# EAGLE design cabletester (EAGLE 9.6.2)
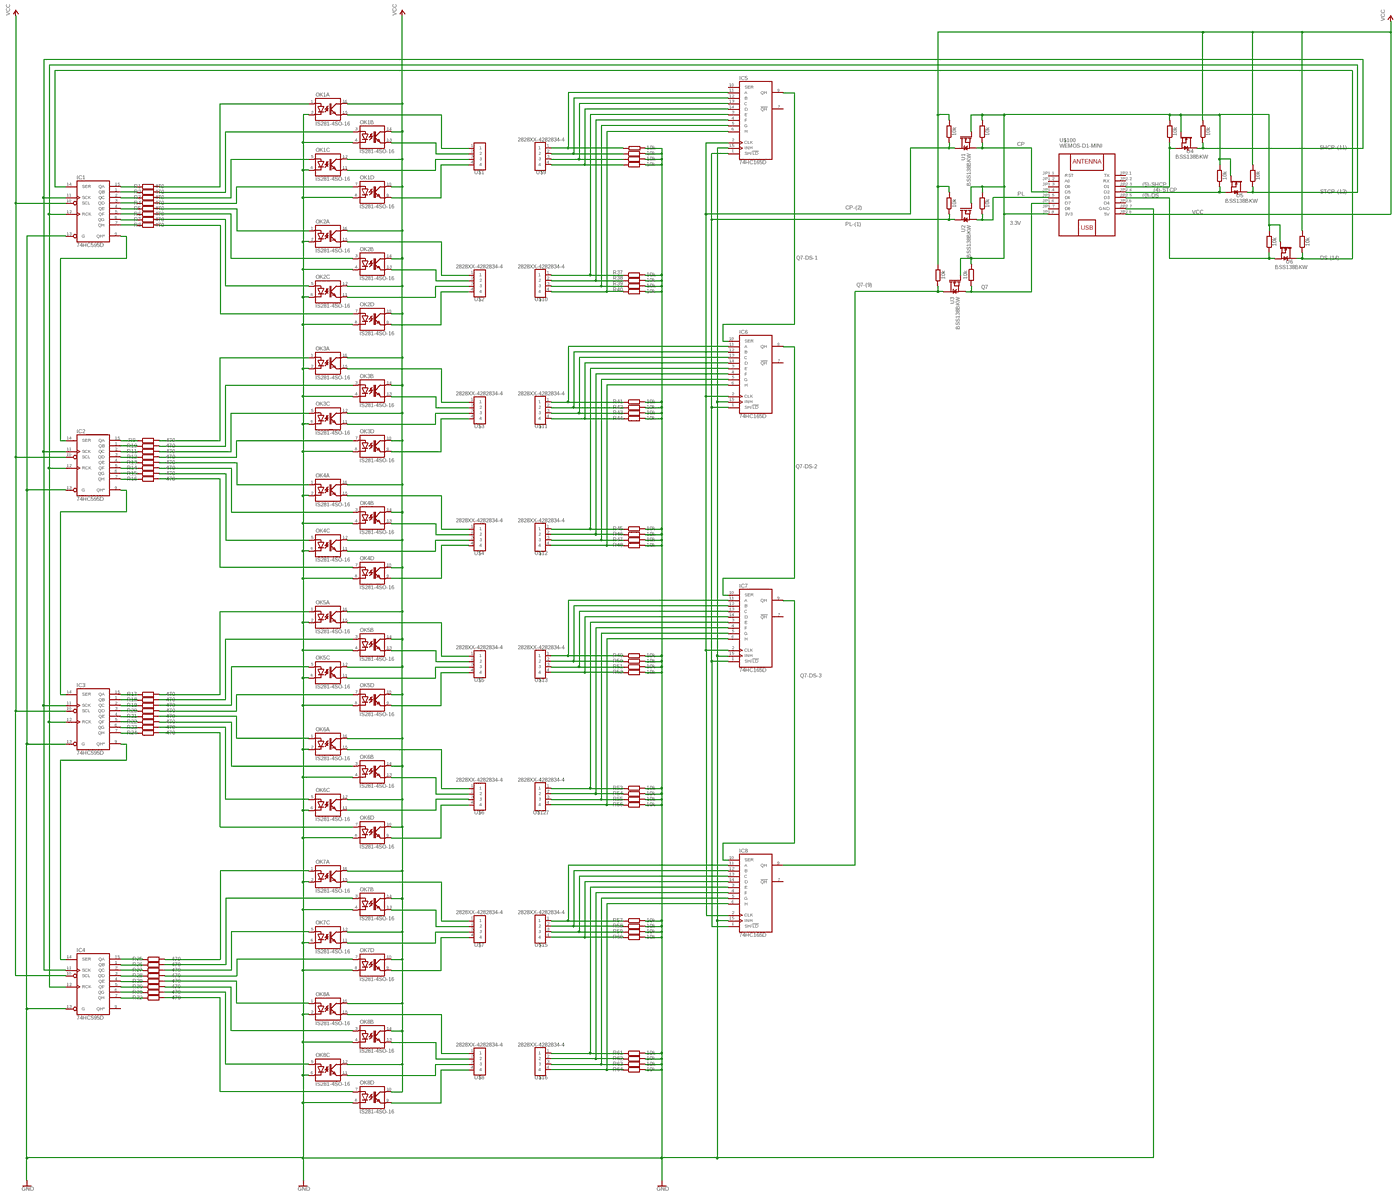
[diagram p0: schematic, sheet 1, overview]
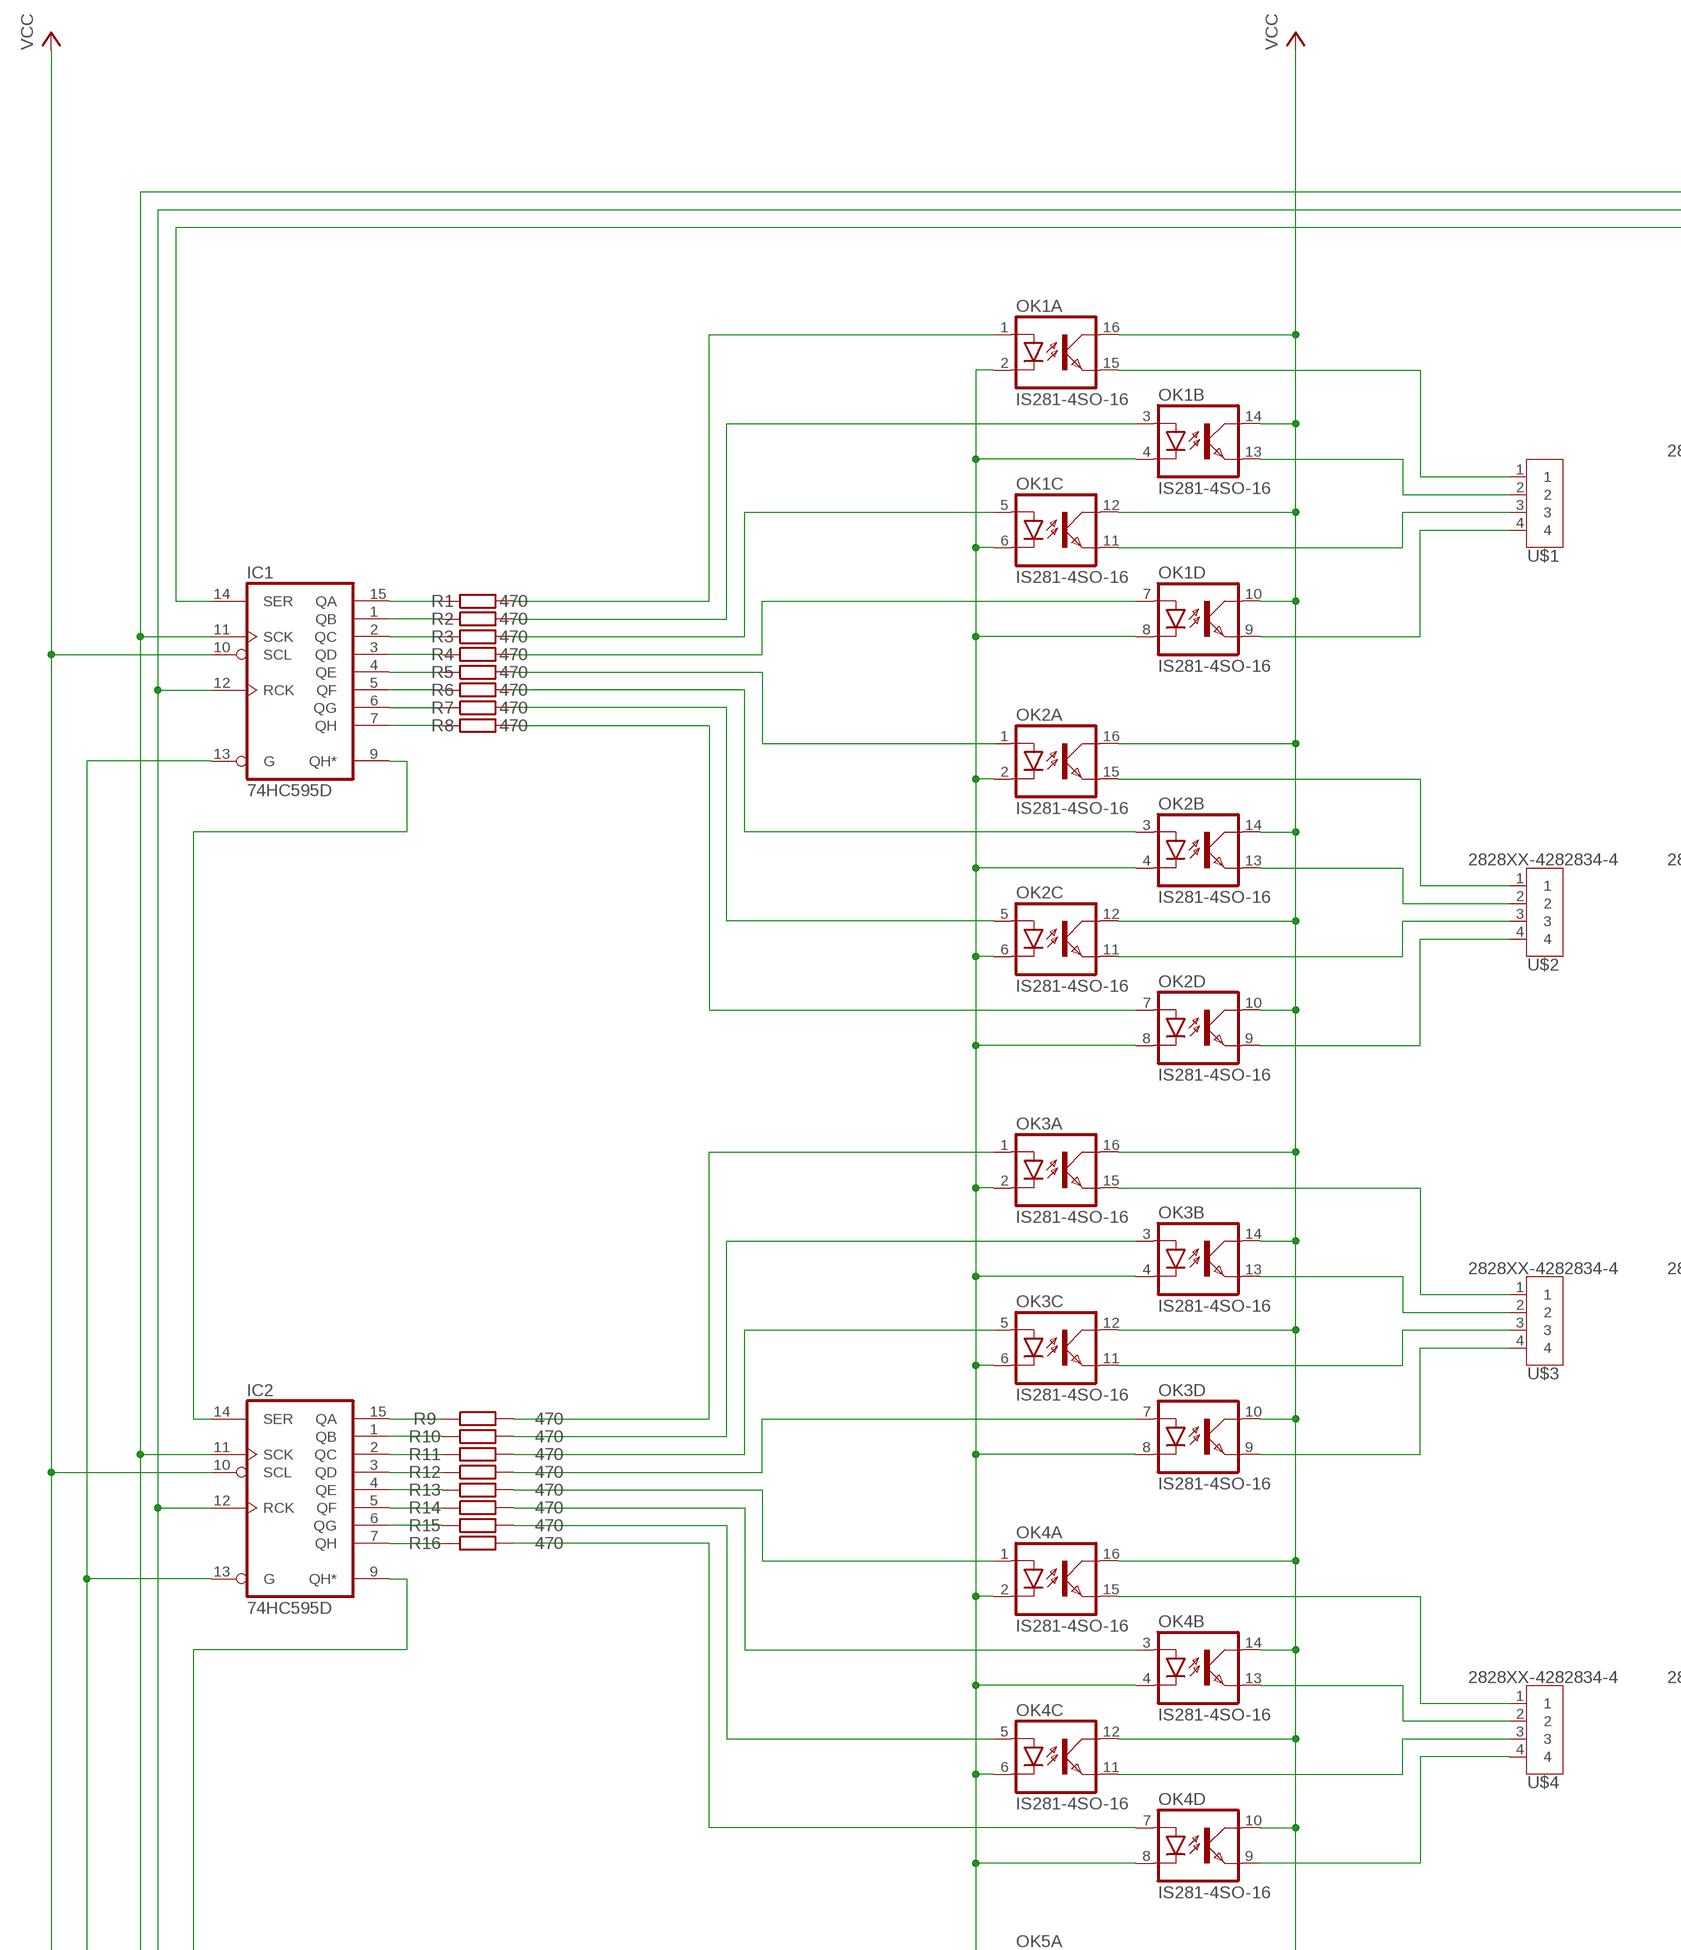
[diagram p1: schematic, sheet 1, part 1 of 4]
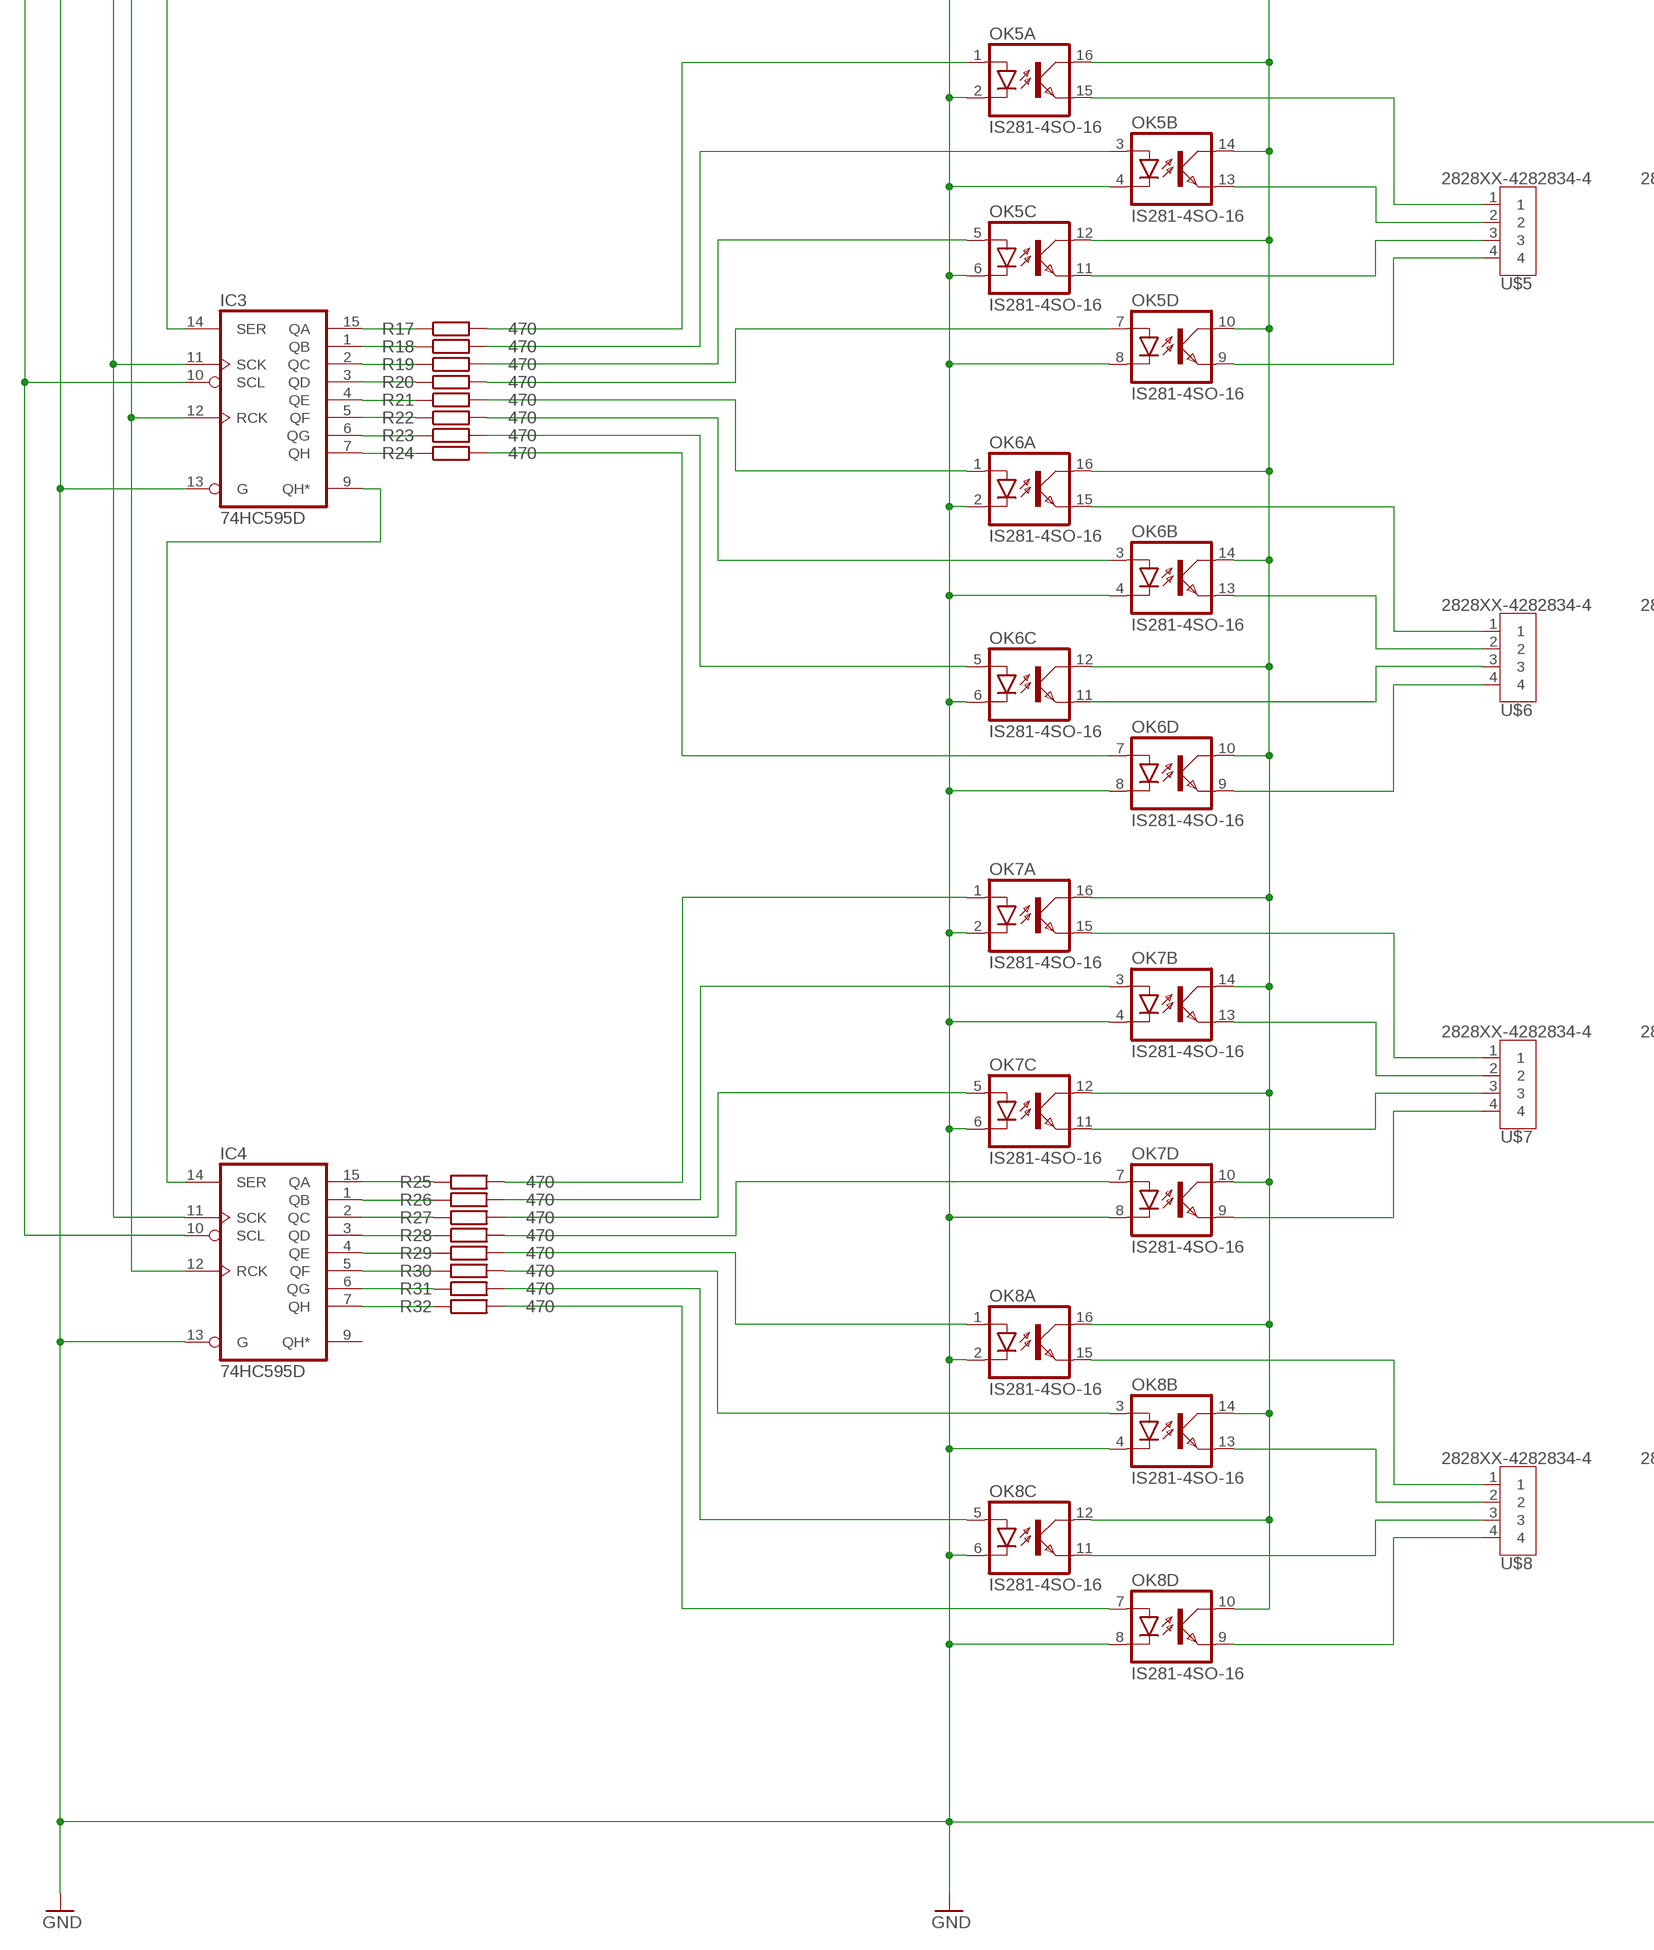
[diagram p2: schematic, sheet 1, part 2 of 4]
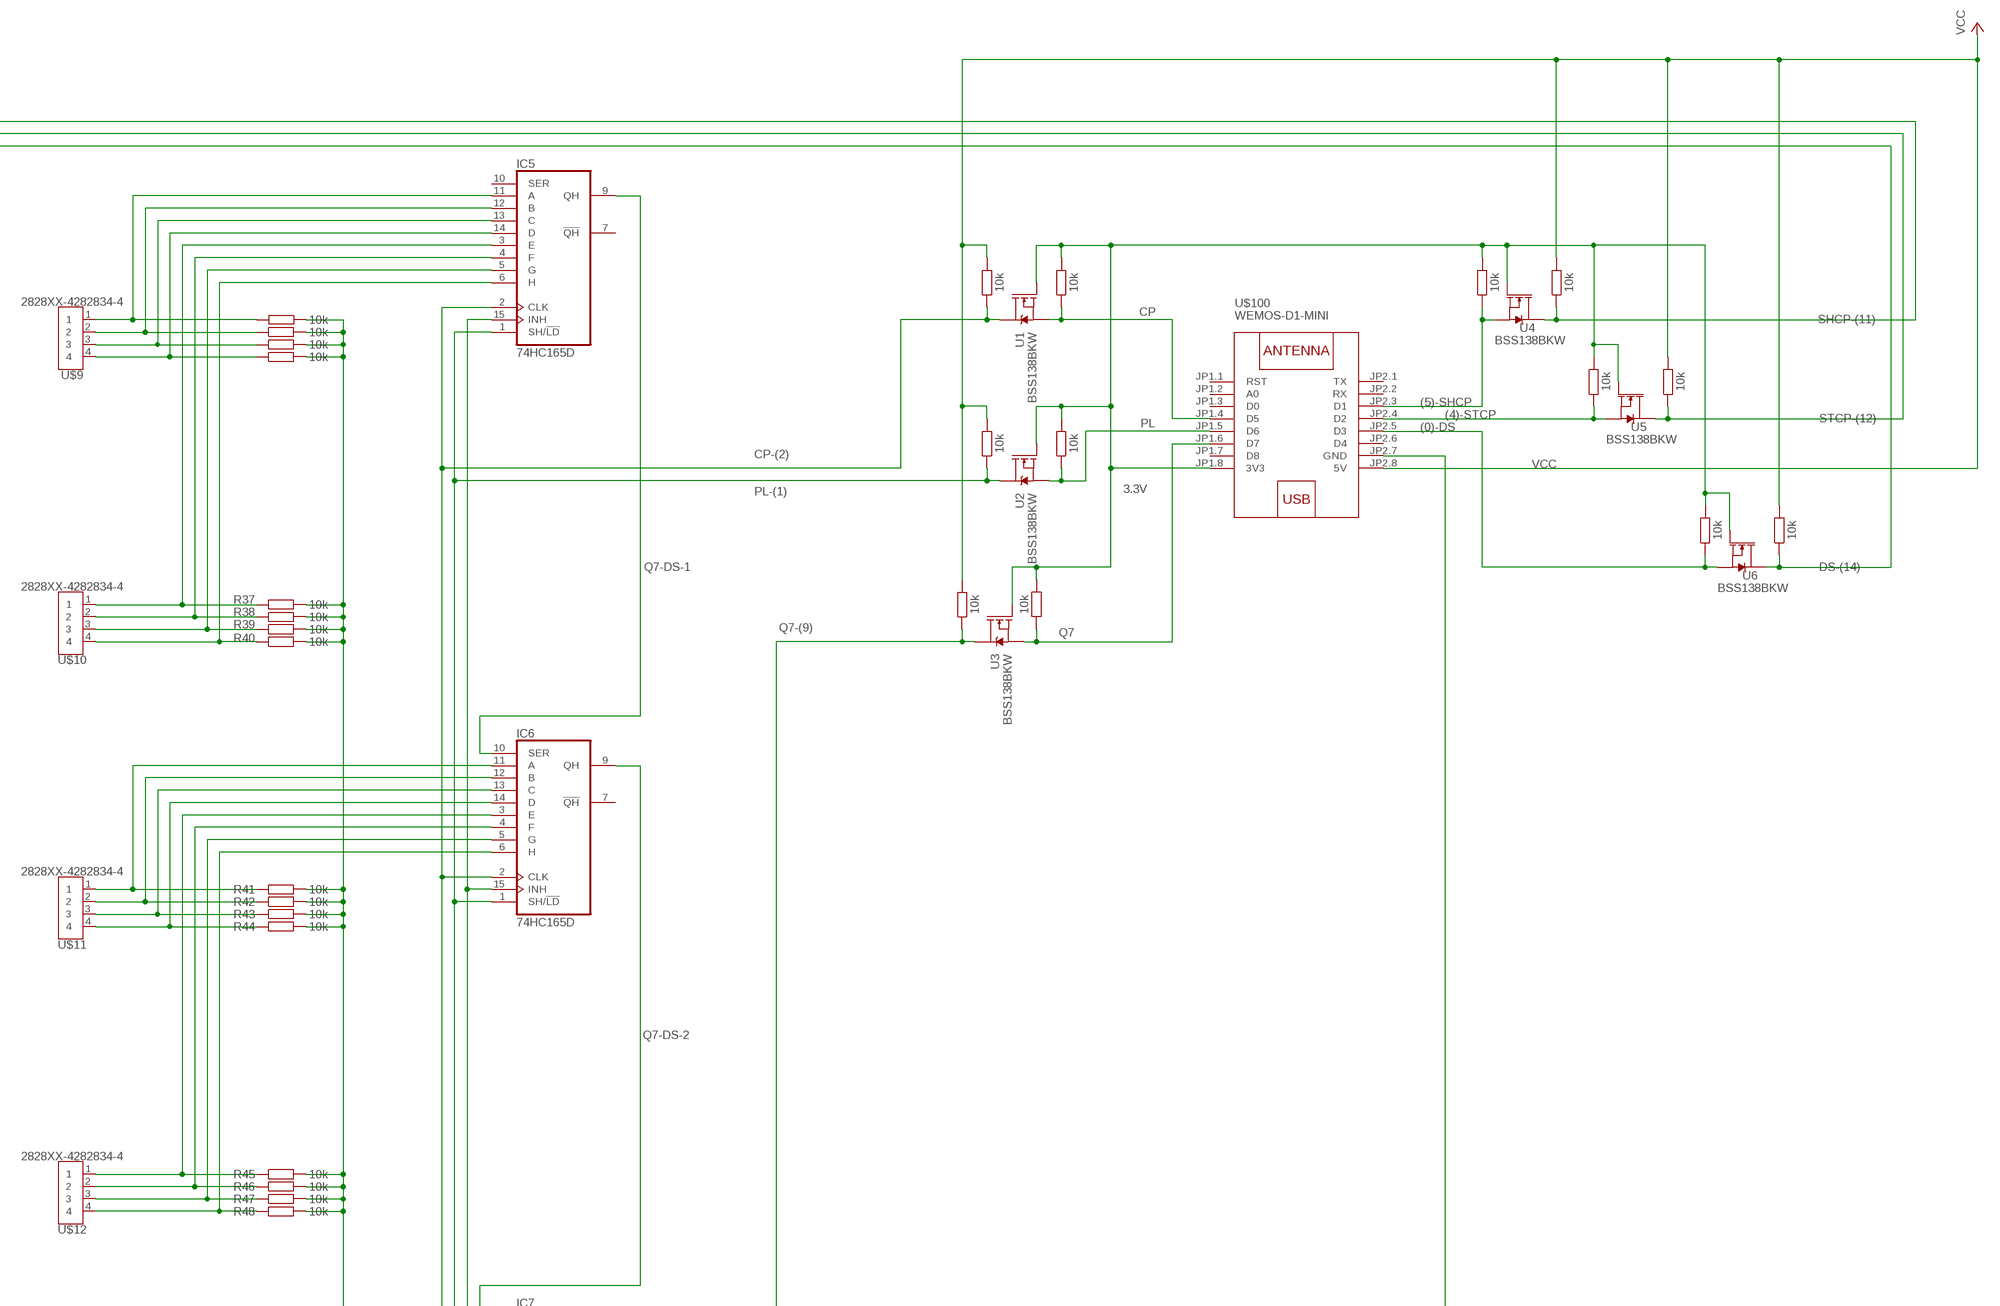
[diagram p3: schematic, sheet 1, part 3 of 4]
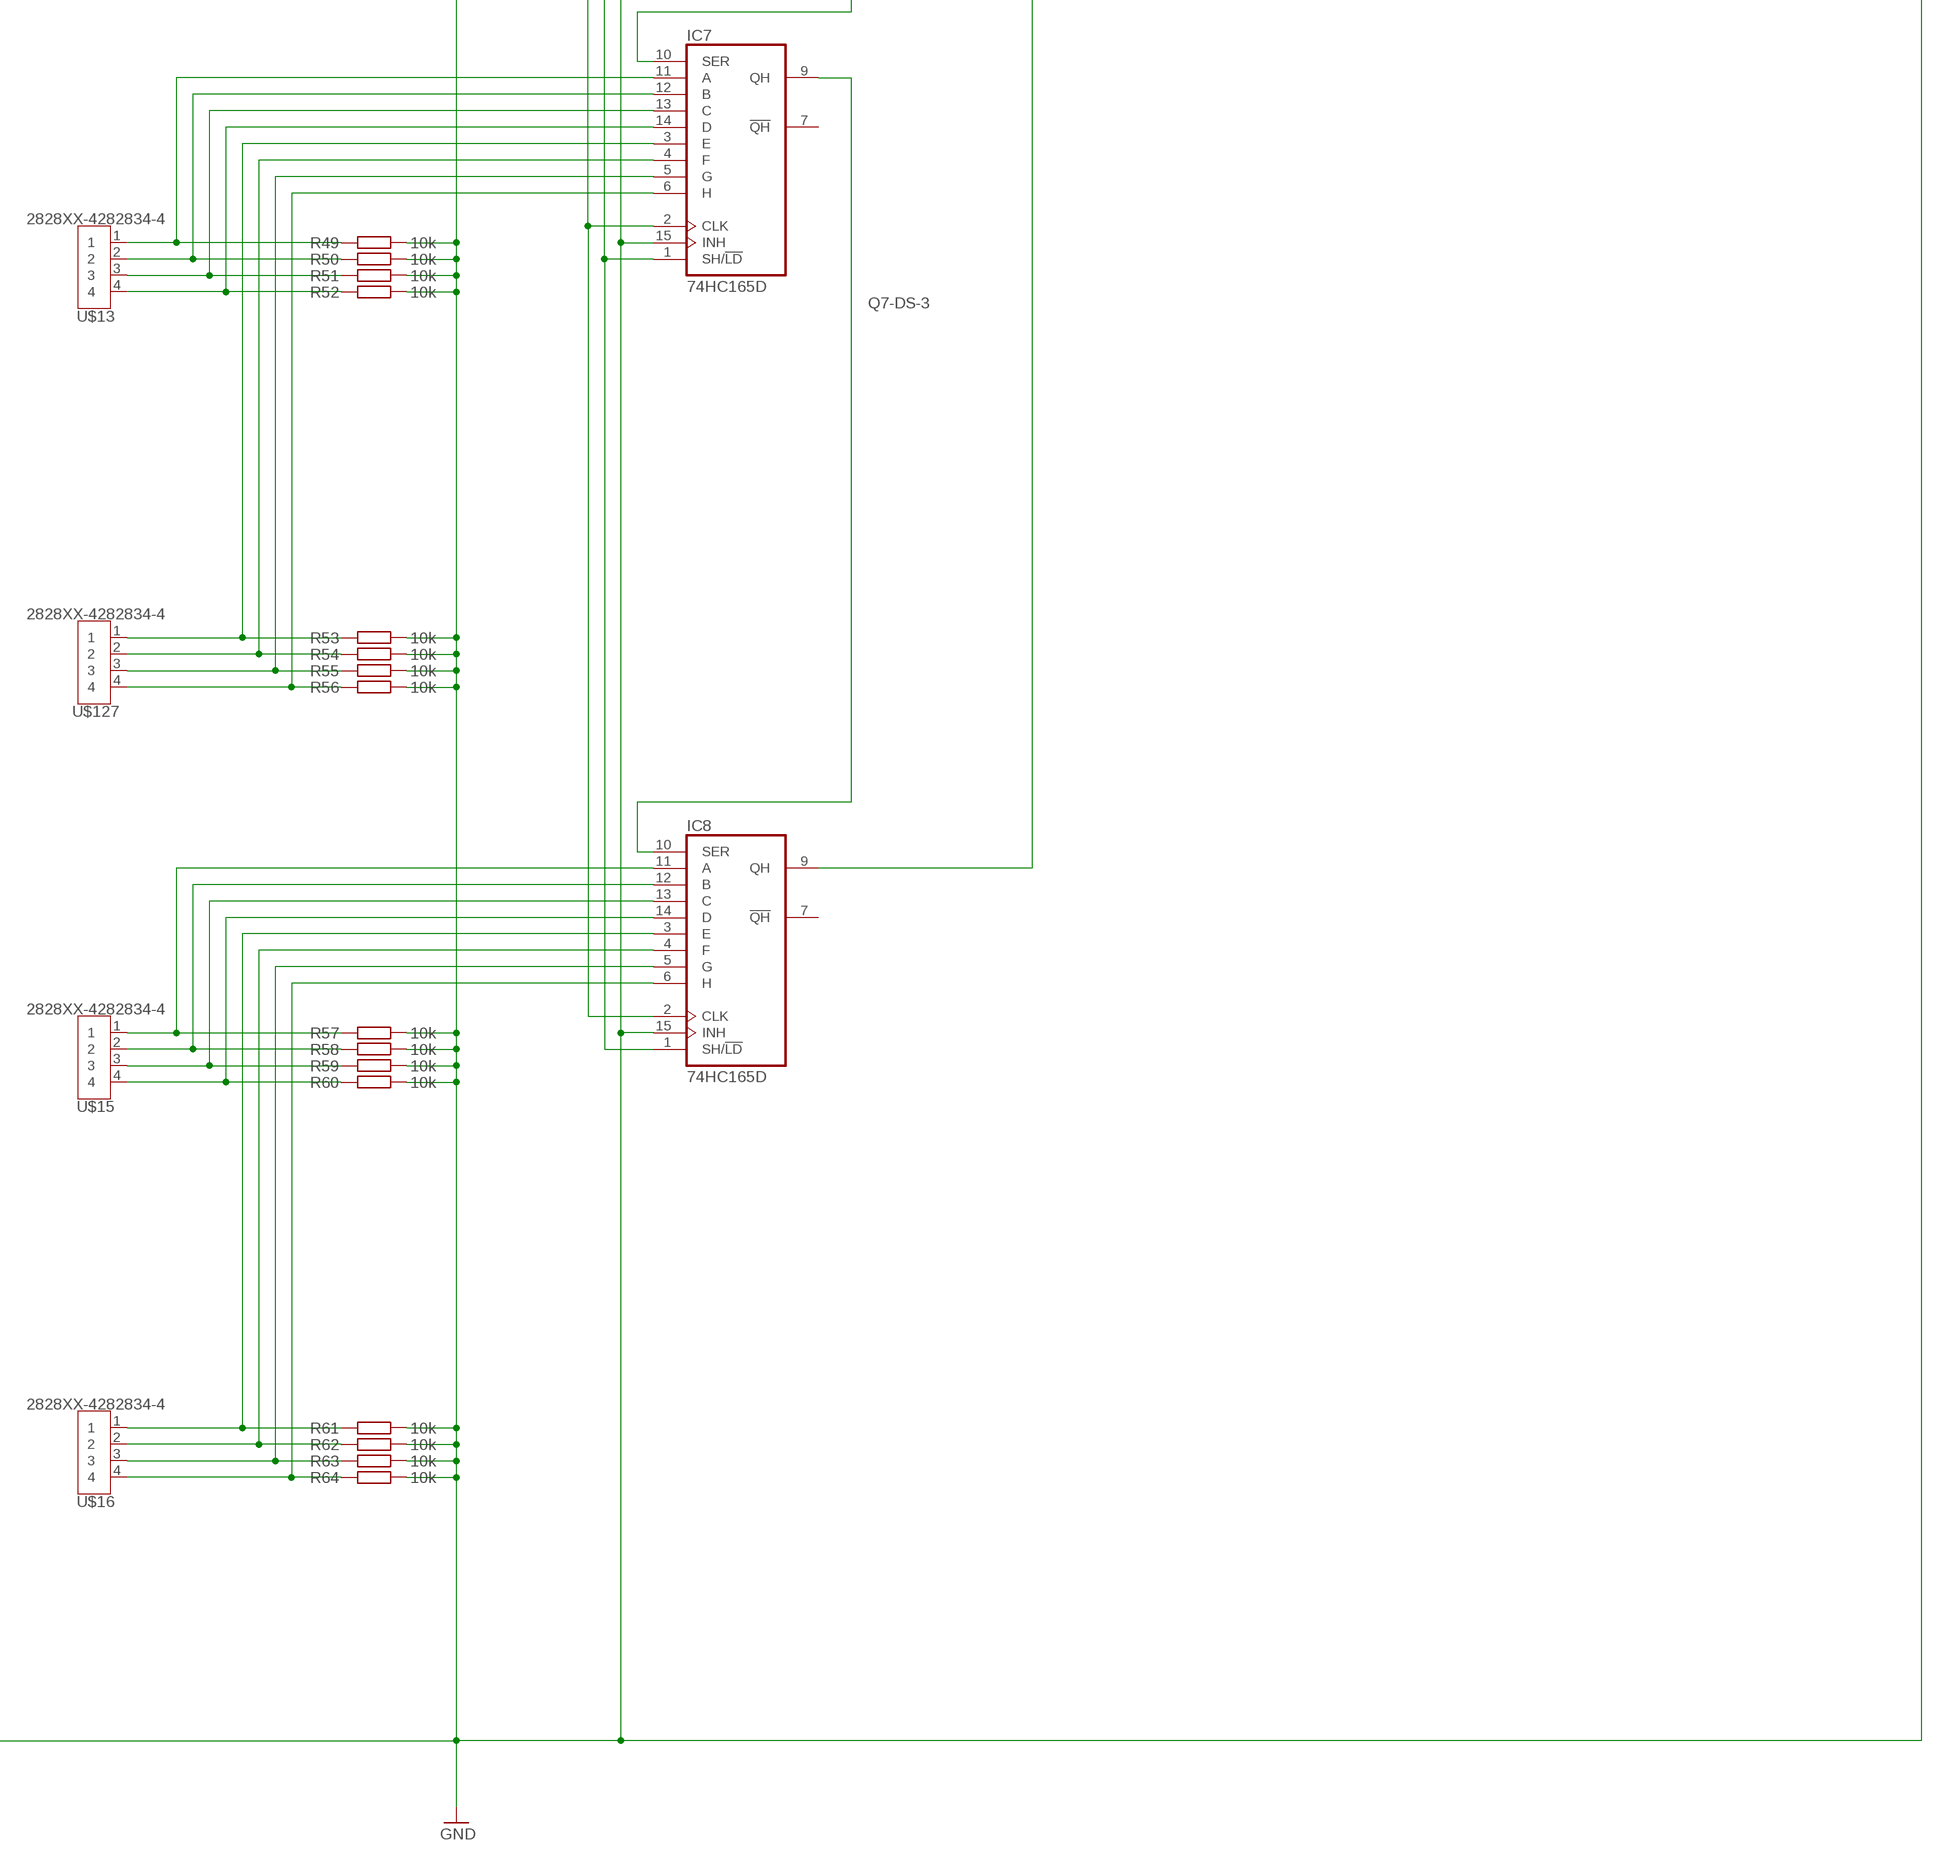
[diagram p4: schematic, sheet 1, part 4 of 4]

## Parts
IC1  74HC595D  [SO16]
IC2  74HC595D  [SO16]
IC3  74HC595D  [SO16]
IC4  74HC595D  [SO16]
IC5  74HC165D  [SO16]
IC6  74HC165D  [SO16]
IC7  74HC165D  [SO16]
IC8  74HC165D  [SO16]
OK1  IS281-4SO-16  [SO16]
OK2  IS281-4SO-16  [SO16]
OK3  IS281-4SO-16  [SO16]
OK4  IS281-4SO-16  [SO16]
OK5  IS281-4SO-16  [SO16]
OK6  IS281-4SO-16  [SO16]
OK7  IS281-4SO-16  [SO16]
OK8  IS281-4SO-16  [SO16]
R1  470  R_CHIP-1206(3216-METRIC)  [RESC3216X70]
R2  470  R_CHIP-1206(3216-METRIC)  [RESC3216X70]
R3  470  R_CHIP-1206(3216-METRIC)  [RESC3216X70]
R4  470  R_CHIP-1206(3216-METRIC)  [RESC3216X70]
R5  470  R_CHIP-1206(3216-METRIC)  [RESC3216X70]
R6  470  R_CHIP-1206(3216-METRIC)  [RESC3216X70]
R7  470  R_CHIP-1206(3216-METRIC)  [RESC3216X70]
R8  470  R_CHIP-1206(3216-METRIC)  [RESC3216X70]
R9  470  R_CHIP-1206(3216-METRIC)  [RESC3216X70]
R10  470  R_CHIP-1206(3216-METRIC)  [RESC3216X70]
R11  470  R_CHIP-1206(3216-METRIC)  [RESC3216X70]
R12  470  R_CHIP-1206(3216-METRIC)  [RESC3216X70]
R13  470  R_CHIP-1206(3216-METRIC)  [RESC3216X70]
R14  470  R_CHIP-1206(3216-METRIC)  [RESC3216X70]
R15  470  R_CHIP-1206(3216-METRIC)  [RESC3216X70]
R16  470  R_CHIP-1206(3216-METRIC)  [RESC3216X70]
R17  470  R_CHIP-1206(3216-METRIC)  [RESC3216X70]
R18  470  R_CHIP-1206(3216-METRIC)  [RESC3216X70]
R19  470  R_CHIP-1206(3216-METRIC)  [RESC3216X70]
R20  470  R_CHIP-1206(3216-METRIC)  [RESC3216X70]
R21  470  R_CHIP-1206(3216-METRIC)  [RESC3216X70]
R22  470  R_CHIP-1206(3216-METRIC)  [RESC3216X70]
R23  470  R_CHIP-1206(3216-METRIC)  [RESC3216X70]
R24  470  R_CHIP-1206(3216-METRIC)  [RESC3216X70]
R25  470  R_CHIP-1206(3216-METRIC)  [RESC3216X70]
R26  470  R_CHIP-1206(3216-METRIC)  [RESC3216X70]
R27  470  R_CHIP-1206(3216-METRIC)  [RESC3216X70]
R28  470  R_CHIP-1206(3216-METRIC)  [RESC3216X70]
R29  470  R_CHIP-1206(3216-METRIC)  [RESC3216X70]
R30  470  R_CHIP-1206(3216-METRIC)  [RESC3216X70]
R31  470  R_CHIP-1206(3216-METRIC)  [RESC3216X70]
R32  470  R_CHIP-1206(3216-METRIC)  [RESC3216X70]
R33  10k  R_CHIP-1206(3216-METRIC)  [RESC3216X70]
R34  10k  R_CHIP-1206(3216-METRIC)  [RESC3216X70]
R35  10k  R_CHIP-1206(3216-METRIC)  [RESC3216X70]
R36  10k  R_CHIP-1206(3216-METRIC)  [RESC3216X70]
R37  10k  R_CHIP-1206(3216-METRIC)  [RESC3216X70]
R38  10k  R_CHIP-1206(3216-METRIC)  [RESC3216X70]
R39  10k  R_CHIP-1206(3216-METRIC)  [RESC3216X70]
R40  10k  R_CHIP-1206(3216-METRIC)  [RESC3216X70]
R41  10k  R_CHIP-1206(3216-METRIC)  [RESC3216X70]
R42  10k  R_CHIP-1206(3216-METRIC)  [RESC3216X70]
R43  10k  R_CHIP-1206(3216-METRIC)  [RESC3216X70]
R44  10k  R_CHIP-1206(3216-METRIC)  [RESC3216X70]
R45  10k  R_CHIP-1206(3216-METRIC)  [RESC3216X70]
R46  10k  R_CHIP-1206(3216-METRIC)  [RESC3216X70]
R47  10k  R_CHIP-1206(3216-METRIC)  [RESC3216X70]
R48  10k  R_CHIP-1206(3216-METRIC)  [RESC3216X70]
R49  10k  R_CHIP-1206(3216-METRIC)  [RESC3216X70]
R50  10k  R_CHIP-1206(3216-METRIC)  [RESC3216X70]
R51  10k  R_CHIP-1206(3216-METRIC)  [RESC3216X70]
R52  10k  R_CHIP-1206(3216-METRIC)  [RESC3216X70]
R53  10k  R_CHIP-1206(3216-METRIC)  [RESC3216X70]
R54  10k  R_CHIP-1206(3216-METRIC)  [RESC3216X70]
R55  10k  R_CHIP-1206(3216-METRIC)  [RESC3216X70]
R56  10k  R_CHIP-1206(3216-METRIC)  [RESC3216X70]
R57  10k  R_CHIP-1206(3216-METRIC)  [RESC3216X70]
R58  10k  R_CHIP-1206(3216-METRIC)  [RESC3216X70]
R59  10k  R_CHIP-1206(3216-METRIC)  [RESC3216X70]
R60  10k  R_CHIP-1206(3216-METRIC)  [RESC3216X70]
R61  10k  R_CHIP-1206(3216-METRIC)  [RESC3216X70]
R62  10k  R_CHIP-1206(3216-METRIC)  [RESC3216X70]
R63  10k  R_CHIP-1206(3216-METRIC)  [RESC3216X70]
R64  10k  R_CHIP-1206(3216-METRIC)  [RESC3216X70]
R65  10k  R_CHIP-1206(3216-METRIC)  [RESC3216X70]
R66  10k  R_CHIP-1206(3216-METRIC)  [RESC3216X70]
R67  10k  R_CHIP-1206(3216-METRIC)  [RESC3216X70]
R68  10k  R_CHIP-1206(3216-METRIC)  [RESC3216X70]
R69  10k  R_CHIP-1206(3216-METRIC)  [RESC3216X70]
R70  10k  R_CHIP-1206(3216-METRIC)  [RESC3216X70]
R71  10k  R_CHIP-1206(3216-METRIC)  [RESC3216X70]
R72  10k  R_CHIP-1206(3216-METRIC)  [RESC3216X70]
R73  10k  R_CHIP-1206(3216-METRIC)  [RESC3216X70]
R74  10k  R_CHIP-1206(3216-METRIC)  [RESC3216X70]
R75  10k  R_CHIP-1206(3216-METRIC)  [RESC3216X70]
R76  10k  R_CHIP-1206(3216-METRIC)  [RESC3216X70]
U1  BSS138BKW  [SOT65P210X110-3N]
U2  BSS138BKW  [SOT65P210X110-3N]
U3  BSS138BKW  [SOT65P210X110-3N]
U4  BSS138BKW  [SOT65P210X110-3N]
U5  BSS138BKW  [SOT65P210X110-3N]
U6  BSS138BKW  [SOT65P210X110-3N]
U$1  2828XX-4282834-4  [TERMBLK_254-4N]
U$2  2828XX-4282834-4  [TERMBLK_254-4N]
U$3  2828XX-4282834-4  [TERMBLK_254-4N]
U$4  2828XX-4282834-4  [TERMBLK_254-4N]
U$5  2828XX-4282834-4  [TERMBLK_254-4N]
U$6  2828XX-4282834-4  [TERMBLK_254-4N]
U$7  2828XX-4282834-4  [TERMBLK_254-4N]
U$8  2828XX-4282834-4  [TERMBLK_254-4N]
U$9  2828XX-4282834-4  [TERMBLK_254-4N]
U$10  2828XX-4282834-4  [TERMBLK_254-4N]
U$11  2828XX-4282834-4  [TERMBLK_254-4N]
U$12  2828XX-4282834-4  [TERMBLK_254-4N]
U$13  2828XX-4282834-4  [TERMBLK_254-4N]
U$15  2828XX-4282834-4  [TERMBLK_254-4N]
U$16  2828XX-4282834-4  [TERMBLK_254-4N]
U$100  WEMOS-D1-MINI  [WEMOS-D1-MINI]
U$127  2828XX-4282834-4  [TERMBLK_254-4N]

## Nets
3.3V: R66.2 R68.2 R70.1 R71.2 R73.2 R75.2 U1.1(G) U2.1(G) U3.1(G) U4.1(G) U5.1(G) U6.1(G) U$100.JP1.8(3V3)
(0)-DS: R75.1 U6.2(S) U$100.JP2.5(D3)
(4)-STCP: R73.1 U5.2(S) U$100.JP2.4(D2)
(5)-SHCP: R71.1 U4.2(S) U$100.JP2.3(D1)
CP: R66.1 U1.2(S) U$100.JP1.4(D5)
CP-(2): IC5.2(CLK) IC6.2(CLK) IC7.2(CLK) IC8.2(CLK) R65.1 U1.3(D)
DS-(14): IC1.14(SER) R76.1 U6.3(D)
GND: IC1.13(G) IC2.13(G) IC3.13(G) IC4.13(G) IC5.15(INH) IC6.15(INH) IC7.15(INH) IC8.15(INH) OK1.2(A:C) OK1.4(B:C) OK1.6(C:C) OK1.8(D:C) OK2.2(A:C) OK2.4(B:C) OK2.6(C:C) OK2.8(D:C) OK3.2(A:C) OK3.4(B:C) OK3.6(C:C) OK3.8(D:C) OK4.2(A:C) OK4.4(B:C) OK4.6(C:C) OK4.8(D:C) OK5.2(A:C) OK5.4(B:C) OK5.6(C:C) OK5.8(D:C) OK6.2(A:C) OK6.4(B:C) OK6.6(C:C) OK6.8(D:C) OK7.2(A:C) OK7.4(B:C) OK7.6(C:C) OK7.8(D:C) OK8.2(A:C) OK8.4(B:C) OK8.6(C:C) OK8.8(D:C) R33.2 R34.2 R35.2 R36.2 R37.2 R38.2 R39.2 R40.2 R41.2 R42.2 R43.2 R44.2 R45.2 R46.2 R47.2 R48.2 R49.2 R50.2 R51.2 R52.2 R53.2 R54.2 R55.2 R56.2 R57.2 R58.2 R59.2 R60.2 R61.2 R62.2 R63.2 R64.2 U$100.JP2.7(GND)
N$1: IC4.1(QB) R26.1
N$2: IC1.9(QH*) IC2.14(SER)
N$3: IC2.9(QH*) IC3.14(SER)
N$4: IC3.9(QH*) IC4.14(SER)
N$5: OK7.1(A:A) R25.2
N$6: IC1.6(QG) R7.1
N$7: IC1.5(QF) R6.1
N$8: IC1.4(QE) R5.1
N$9: IC1.3(QD) R4.1
N$10: IC1.2(QC) R3.1
N$11: IC1.1(QB) R2.1
N$12: IC1.15(QA) R1.1
N$13: IC1.7(QH) R8.1
N$14: OK1.1(A:A) R1.2
N$15: OK1.3(B:A) R2.2
N$16: OK1.5(C:A) R3.2
N$17: OK1.7(D:A) R4.2
N$18: OK2.1(A:A) R5.2
N$19: OK2.3(B:A) R6.2
N$20: OK1.15(A:EMIT) U$1.1
N$21: OK1.13(B:EMIT) U$1.2
N$22: OK1.11(C:EMIT) U$1.3
N$23: OK1.9(D:EMIT) U$1.4
N$24: OK2.15(A:EMIT) U$2.1
N$25: OK2.13(B:EMIT) U$2.2
N$26: OK2.11(C:EMIT) U$2.3
N$27: OK2.9(D:EMIT) U$2.4
N$28: OK2.5(C:A) R7.2
N$29: OK2.7(D:A) R8.2
N$30: IC2.1(QB) R10.1
N$31: IC2.2(QC) R11.1
N$32: IC2.3(QD) R12.1
N$33: IC2.4(QE) R13.1
N$34: IC2.5(QF) R14.1
N$35: IC2.6(QG) R15.1
N$36: IC2.7(QH) R16.1
N$37: IC2.15(QA) R9.1
N$38: OK3.1(A:A) R9.2
N$39: OK3.3(B:A) R10.2
N$40: OK3.5(C:A) R11.2
N$41: OK3.7(D:A) R12.2
N$42: OK4.1(A:A) R13.2
N$43: OK4.3(B:A) R14.2
N$44: OK4.5(C:A) R15.2
N$45: OK4.7(D:A) R16.2
N$46: IC3.6(QG) R23.1
N$47: IC3.5(QF) R22.1
N$48: IC3.4(QE) R21.1
N$49: IC3.3(QD) R20.1
N$50: IC3.2(QC) R19.1
N$51: IC3.1(QB) R18.1
N$52: IC3.7(QH) R24.1
N$53: IC3.15(QA) R17.1
N$54: OK5.1(A:A) R17.2
N$55: OK5.3(B:A) R18.2
N$56: OK5.5(C:A) R19.2
N$57: OK5.7(D:A) R20.2
N$58: OK6.1(A:A) R21.2
N$59: OK6.3(B:A) R22.2
N$60: OK6.5(C:A) R23.2
N$61: OK6.7(D:A) R24.2
N$62: OK7.3(B:A) R26.2
N$63: OK7.5(C:A) R27.2
N$64: OK7.7(D:A) R28.2
N$65: OK8.1(A:A) R29.2
N$66: OK3.15(A:EMIT) U$3.1
N$67: OK3.13(B:EMIT) U$3.2
N$68: OK3.11(C:EMIT) U$3.3
N$69: OK3.9(D:EMIT) U$3.4
N$70: OK4.15(A:EMIT) U$4.1
N$71: OK4.13(B:EMIT) U$4.2
N$72: OK4.11(C:EMIT) U$4.3
N$73: OK4.9(D:EMIT) U$4.4
N$74: OK5.15(A:EMIT) U$5.1
N$75: OK5.13(B:EMIT) U$5.2
N$76: OK5.11(C:EMIT) U$5.3
N$77: OK5.9(D:EMIT) U$5.4
N$78: OK6.15(A:EMIT) U$6.1
N$79: OK6.13(B:EMIT) U$6.2
N$80: OK6.11(C:EMIT) U$6.3
N$81: OK6.9(D:EMIT) U$6.4
N$82: IC5.11(A) R33.1 U$9.1
N$83: IC6.11(A) R41.1 U$11.1
N$84: IC5.13(C) R35.1 U$9.3
N$85: IC5.14(D) R36.1 U$9.4
N$86: IC5.12(B) R34.1 U$9.2
N$87: IC6.12(B) R42.1 U$11.2
N$88: IC5.3(E) R37.1 U$10.1
N$89: IC5.4(F) R38.1 U$10.2
N$90: IC5.5(G) R39.1 U$10.3
N$91: IC5.6(H) R40.1 U$10.4
N$92: IC6.13(C) R43.1 U$11.3
N$93: IC6.14(D) R44.1 U$11.4
N$94: IC6.3(E) R45.1 U$12.1
N$95: IC6.4(F) R46.1 U$12.2
N$96: IC6.5(G) R47.1 U$12.3
N$97: IC6.6(H) R48.1 U$12.4
N$98: IC7.11(A) R49.1 U$13.1
N$99: IC7.12(B) R50.1 U$13.2
N$100: IC7.13(C) R51.1 U$13.3
N$101: IC7.14(D) R52.1 U$13.4
N$102: IC7.3(E) R53.1 U$127.1
N$103: IC7.4(F) R54.1 U$127.2
N$104: IC7.5(G) R55.1 U$127.3
N$105: IC7.6(H) R56.1 U$127.4
N$106: OK8.3(B:A) R30.2
N$107: OK8.5(C:A) R31.2
N$108: OK8.7(D:A) R32.2
N$109: IC4.2(QC) R27.1
N$110: IC4.3(QD) R28.1
N$111: IC4.4(QE) R29.1
N$112: IC4.5(QF) R30.1
N$113: IC4.6(QG) R31.1
N$114: IC4.7(QH) R32.1
N$116: IC4.15(QA) R25.1
N$117: OK7.15(A:EMIT) U$7.1
N$118: OK7.13(B:EMIT) U$7.2
N$119: OK7.11(C:EMIT) U$7.3
N$120: OK7.9(D:EMIT) U$7.4
N$121: OK8.15(A:EMIT) U$8.1
N$122: OK8.13(B:EMIT) U$8.2
N$123: OK8.11(C:EMIT) U$8.3
N$124: OK8.9(D:EMIT) U$8.4
N$125: IC8.11(A) R57.1 U$15.1
N$126: IC8.12(B) R58.1 U$15.2
N$127: IC8.13(C) R59.1 U$15.3
N$128: IC8.14(D) R60.1 U$15.4
N$129: IC8.3(E) R61.1 U$16.1
N$130: IC8.4(F) R62.1 U$16.2
N$131: IC8.5(G) R63.1 U$16.3
N$132: IC8.6(H) R64.1 U$16.4
PL: R68.1 U2.2(S) U$100.JP1.5(D6)
PL-(1): IC5.1(SH/!LD) IC6.1(SH/!LD) IC7.1(SH/!LD) IC8.1(SH/!LD) R67.1 U2.3(D)
Q7: R70.2 U3.2(S) U$100.JP1.6(D7)
Q7-(9): IC8.9(QH) R69.1 U3.3(D)
Q7-DS-1: IC5.9(QH) IC6.10(SER)
Q7-DS-2: IC6.9(QH) IC7.10(SER)
Q7-DS-3: IC7.9(QH) IC8.10(SER)
SHCP-(11): IC1.11(SCK) IC2.11(SCK) IC3.11(SCK) IC4.11(SCK) R72.1 U4.3(D)
STCP-(12): IC1.12(RCK) IC2.12(RCK) IC3.12(RCK) IC4.12(RCK) R74.1 U5.3(D)
VCC: IC1.10(SCL) IC2.10(SCL) IC3.10(SCL) IC4.10(SCL) OK1.10(D:COL) OK1.12(C:COL) OK1.14(B:COL) OK1.16(A:COL) OK2.10(D:COL) OK2.12(C:COL) OK2.14(B:COL) OK2.16(A:COL) OK3.10(D:COL) OK3.12(C:COL) OK3.14(B:COL) OK3.16(A:COL) OK4.10(D:COL) OK4.12(C:COL) OK4.14(B:COL) OK4.16(A:COL) OK5.10(D:COL) OK5.12(C:COL) OK5.14(B:COL) OK5.16(A:COL) OK6.10(D:COL) OK6.12(C:COL) OK6.14(B:COL) OK6.16(A:COL) OK7.10(D:COL) OK7.12(C:COL) OK7.14(B:COL) OK7.16(A:COL) OK8.10(D:COL) OK8.12(C:COL) OK8.14(B:COL) OK8.16(A:COL) R65.2 R67.2 R69.2 R72.2 R74.2 R76.2 U$100.JP2.8(5V)
Unconnected: IC4.9(QH*) IC5.7(!QH) IC5.10(SER) IC6.7(!QH) IC7.7(!QH) IC8.7(!QH) U$100.JP1.1(RST) U$100.JP1.2(A0) U$100.JP1.3(D0) U$100.JP1.7(D8) U$100.JP2.1(TX) U$100.JP2.2(RX) U$100.JP2.6(D4)

## Power pins joined to a net without a drawn wire
GND: IC1.8(GND) IC2.8(GND) IC3.8(GND) IC4.8(GND) IC5.8(GND) IC6.8(GND) IC7.8(GND) IC8.8(GND)
VCC: IC1.16(VCC) IC2.16(VCC) IC3.16(VCC) IC4.16(VCC) IC5.16(VCC) IC6.16(VCC) IC7.16(VCC) IC8.16(VCC)

## Library data of the parts
IC1-IC4 = 74xx-eu:74*595: 8-bit SHIFT REGISTER, output latch
IC5-IC8 = 74xx-eu:74*165: 8-bit parallel load SHIFT REGISTER
OK1-OK8 = IS281-4-optocoupler:IS281-4: ISOCOM IS281-4 PHOTOCOUPLER
R1-R76 = Resistor:R: Resistor Fixed - Generic; CATEGORY: Resistor; SUB-CATEGORY: Fixed
U1-U6 = bss138:BSS138BKW: N-channel Trench MOSFET; MPN: BSS138BKW; OC_FARNELL: 2053836; OC_NEWARK: 61T7488; PACKAGE: SOT-23-3; SUPPLIER: NXP
U$1-U$13 U$15 U$16 U$127 = Connector:2828XX-4: 4 Position Wire to Board Terminal Block Horizontal with Board Datasheet <https://www.te.com.cn/commerce/DocumentDelivery/DDEController?Action=showdoc&DocId=Catalog+Section%7F1308389_EUROSTYLE_TERMINAL_BLOCKS%7F0607%7Fpdf%7FEnglish%7FENG_CS_1308389_EUROSTYLE_TERMINAL_BLOCKS_0607.pdf%7F2-282837-5>; CATEGORY: Connector; DESCRIPTION: TERM BLK 4P SIDE ENT 2.54mm PCB; MANUFACTURER: TE Connectivity; MPN: 282834-4; OPERATING_TEMPERATURE: 40°C to +105°C; PART_STATUS: Active; ROHS_COMPLIANCE: RoHS Compliant; SERIES: 282834; SUBCATEGORY: Terminal Block; TYPE: Side Wire Entry
U$100 = diy-modules:WEMOS-D1-MINI: WEMOS D1 mini: Mini Wi-Fi Board based on ESP-8266 device More details can be found here: https://www.wemos.cc/product/d1-mini.html Click here to find device on ebay.com <http://www.ebay.com/sch/wemos+d1+mini+nodemcu>

## Board
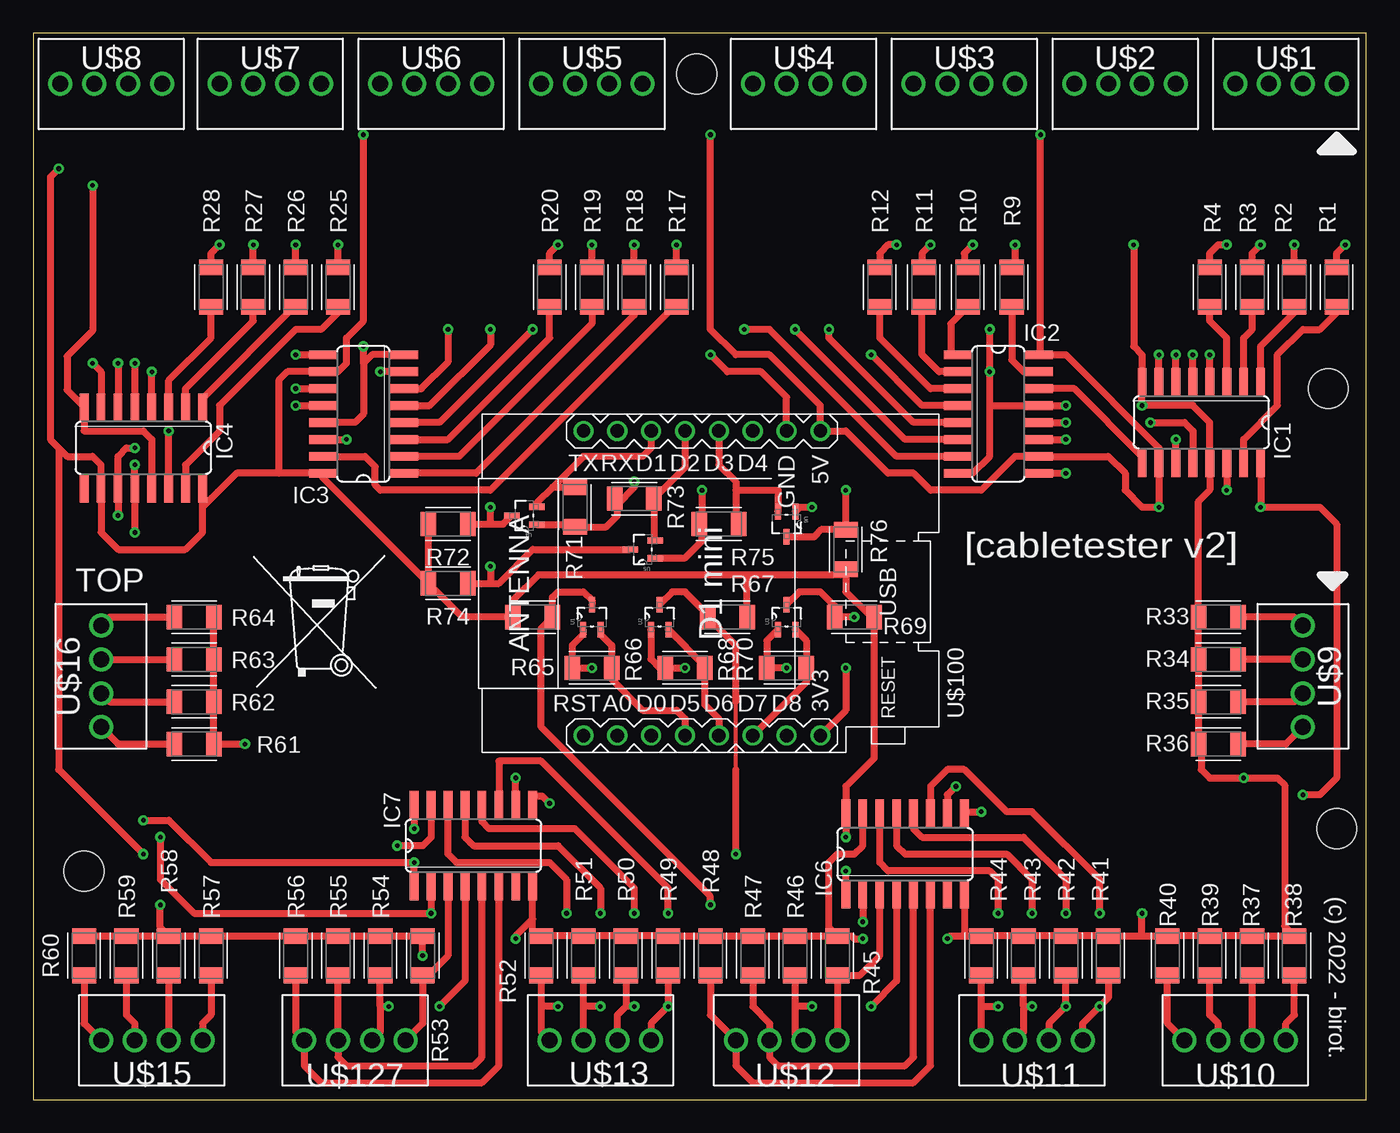
[diagram p5: board, top side]
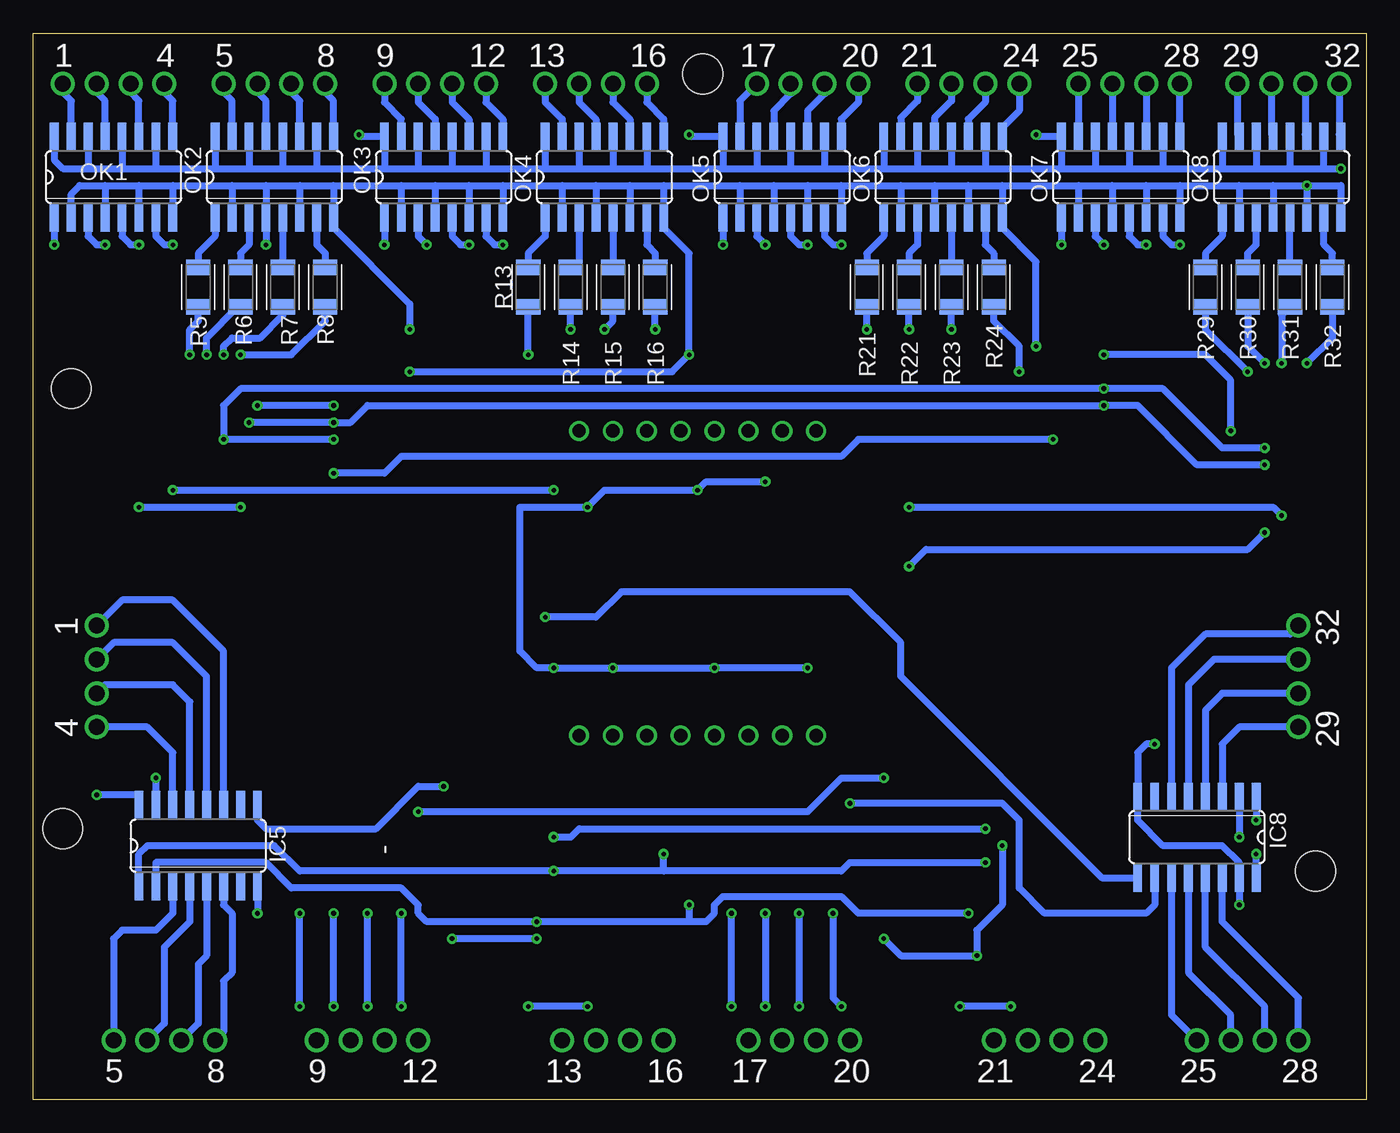
[diagram p6: board, bottom side, seen from below]

Size 100 x 80 mm. Coordinates in mm from the lower left corner, seen from the top.
Outline: 0,0 100,0 100,80 0,80 0,0
Copper layers (1*16): Top 0.035mm / dielectric 1.5mm / Bottom 0.035mm
Design rules "default": minimum track width 6mil, minimum drill 0.35mm, track to track 6mil, track to pad 6mil, pad to pad 6mil, via to via 6mil, smd to smd 6mil, copper to edge 40mil, drill to drill 6mil, minimum pad ring 10mil, minimum via ring 8mil, stop-mask expansion 4mil, vias tented up to drill 0mil, thermal gap 10mil
Holes 3 mm at 49.78,76.96 3.81,17.14 97.16,53.34 97.79,20.32

### Footprints (pad centres in the part's own frame; a part is rotated, then mirrored left to right if it is on the bottom)
SO16 = smd 0.66 x 2.032: 1 -4.445,-3.073; 2 -3.175,-3.073; 3 -1.905,-3.073; 4 -0.635,-3.073; 5 0.635,-3.073; 6 1.905,-3.073; 7 3.175,-3.073; 8 4.445,-3.073; 9 4.445,3.073; 10 3.175,3.073; 11 1.905,3.073; 12 0.635,3.073; 13 -0.635,3.073; 14 -1.905,3.073; 15 -3.175,3.073; 16 -4.445,3.073
RESC3216X70 = smd 1.165 x 1.815: 1 -1.475,0; 2 1.475,0
SOT65P210X110-3N = smd 1.168 x 0.457: 1 -0.94,0.66; 2 -0.94,-0.66; 3 0.94,0
TERMBLK_254-4N = drill 1.2: 1 0,0; 2 2.54,0; 3 5.08,0; 4 7.62,0
WEMOS-D1-MINI = drill 1: JP1.1 -11.43,9.525; JP1.2 -11.43,6.985; JP1.3 -11.43,4.445; JP1.4 -11.43,1.905; JP1.5 -11.43,-0.635; JP1.6 -11.43,-3.175; JP1.7 -11.43,-5.715; JP1.8 -11.43,-8.255; JP2.1 11.43,9.525; JP2.2 11.43,6.985; JP2.3 11.43,4.445; JP2.4 11.43,1.905; JP2.5 11.43,-0.635; JP2.6 11.43,-3.175; JP2.7 11.43,-5.715; JP2.8 11.43,-8.255

### Placement (x,y rotation side)
IC1  87.63,50.8 180 top
IC2  72.39,51.44 270 top
IC3  24.77,51.44 90 top
IC4  8.26,48.9 180 top
IC5  87.63,19.05 0 bottom
IC6  65.41,18.41 0 top
IC7  33.02,19.05 0 top
IC8  12.7,19.68 180 bottom
OK1  93.98,69.22 0 bottom
OK2  81.92,69.22 0 bottom
OK3  69.22,69.22 0 bottom
OK4  57.15,69.22 0 bottom
OK5  43.81,69.22 0 bottom
OK6  31.75,69.22 0 bottom
OK7  18.41,69.22 0 bottom
OK8  6.35,69.22 0 bottom
R1  97.79,60.96 90 top
R2  94.61,60.96 90 top
R3  91.44,60.96 90 top
R4  88.27,60.96 90 top
R5  87.63,60.96 90 bottom
R6  84.45,60.96 90 bottom
R7  81.28,60.96 90 bottom
R8  78.11,60.96 90 bottom
R9  73.41,60.96 90 top
R10  70.1,60.96 90 top
R11  66.8,60.96 90 top
R12  63.5,60.96 90 top
R13  62.87,60.96 90 bottom
R14  59.69,60.96 90 bottom
R15  56.52,60.96 90 bottom
R16  53.34,60.96 90 bottom
R17  48.26,60.96 90 top
R18  45.09,60.96 90 top
R19  41.91,60.96 90 top
R20  38.73,60.96 90 top
R21  37.47,60.96 90 bottom
R22  34.29,60.96 90 bottom
R23  31.11,60.96 90 bottom
R24  27.94,60.96 90 bottom
R25  22.86,60.96 90 top
R26  19.68,60.96 90 top
R27  16.51,60.96 90 top
R28  13.34,60.96 90 top
R29  12.06,60.96 90 bottom
R30  8.89,60.96 90 bottom
R31  5.71,60.96 90 bottom
R32  2.54,60.96 90 bottom
R33  88.9,36.2 180 top
R34  88.9,33.02 180 top
R35  88.9,29.84 180 top
R36  88.9,26.67 180 top
R37  94.61,10.79 90 top
R38  91.44,10.79 90 top
R39  88.27,10.79 90 top
R40  85.09,10.79 90 top
R41  80.64,10.79 90 top
R42  77.47,10.79 90 top
R43  74.3,10.79 90 top
R44  71.12,10.79 90 top
R45  60.33,10.79 90 top
R46  57.15,10.79 90 top
R47  53.98,10.79 90 top
R48  50.8,10.79 90 top
R49  47.62,10.79 90 top
R50  44.45,10.79 90 top
R51  41.27,10.79 90 top
R52  38.1,10.79 90 top
R53  29.21,10.79 90 top
R54  26.04,10.79 90 top
R55  22.86,10.79 90 top
R56  19.68,10.79 90 top
R57  13.34,10.79 90 top
R58  10.16,10.79 90 top
R59  6.99,10.79 90 top
R60  3.81,10.79 90 top
R61  12.06,26.67 0 top
R62  12.06,29.84 0 top
R63  12.06,33.02 0 top
R64  12.06,36.2 0 top
R65  37.47,36.2 180 top
R66  41.91,32.38 180 top
R67  52.07,36.2 0 top
R68  48.9,32.38 180 top
R69  61.59,36.2 0 top
R70  56.52,32.38 0 top
R71  40.64,44.45 270 top
R72  31.11,43.18 180 top
R73  45.09,45.09 180 top
R74  31.11,38.73 180 top
R75  51.44,43.18 180 top
R76  60.96,41.27 270 top
U1  41.91,36.2 90 top
U2  46.99,36.2 90 top
U3  56.52,36.2 90 top
U4  36.83,43.81 180 top
U5  45.72,41.27 180 top
U6  56.52,43.18 270 top
U$1  97.79,76.2 180 top
U$2  85.72,76.2 180 top
U$3  73.66,76.2 180 top
U$4  61.59,76.2 180 top
U$5  45.72,76.2 180 top
U$6  33.66,76.2 180 top
U$7  21.59,76.2 180 top
U$8  9.65,76.2 180 top
U$9  95.25,35.56 270 top
U$10  93.98,4.45 180 top
U$11  78.74,4.45 180 top
U$12  60.33,4.45 180 top
U$13  46.35,4.45 180 top
U$14  [MUELLTONNE_10.00]  15.88,30.48 0 top
U$15  12.7,4.45 180 top
U$16  5.08,27.94 90 top
U$100  50.8,38.73 90 top
U$127  27.94,4.45 180 top

### Tracks (layer width: path | path; a pad name or v marks a point on that pad's centre or on a via)
3.3V  (via drill 0.35)
  Top 0.508: U3.1 55.04,34.44 R70.1 v56.52,32.38 | U2.1 46.33,33.05 46.99,32.38 R68.2 v48.9,32.38 | U1.1 41.25,34.9 40.44,34.09 R66.2 v41.91,32.38 | U$100.JP1.8 60.96,29.21 v60.96,32.38 | U6.1 57.51,44.45 v58.42,44.45 | v50.16,45.72 50.16,43.38 | 50.16,43.38 R75.2 | v45.09,46.35 45.09,45.92 43.81,44.66 43.81,43.81 42.98,42.98 R71.2 40.46,43.16 U4.1 | 43.81,45.29 R73.2 | U5.1 46.69,40.64 48.9,40.64 50.16,41.91 50.16,43.38
  Bottom 0.508: v41.91,32.38 v48.9,32.38 v56.52,32.38 v60.96,32.38 62.23,32.38 63.5,33.66 63.5,44.45 v58.42,44.45 57.15,45.72 v50.16,45.72 49.53,46.35 v45.09,46.35
(0)-DS
  Top 0.508: U$100.JP2.5 51.44,47.62 52.7,46.35 52.7,43.38 R75.1 | 52.7,45.72 55.88,45.72 55.88,44.15 U6.2
(4)-STCP
  Top 0.508: U$100.JP2.4 48.9,47.42 R73.1 46.56,42.03 U5.2
(5)-SHCP
  Top 0.508: U$100.JP2.3 46.35,48.9 45.72,48.26 41.27,48.26 38.94,45.92 | 38.94,45.92 37.77,44.76 U4.2 | R71.1 38.94,45.92
CP
  Top 0.508: U1.2 42.57,34.9 43.38,34.09 R66.1 43.38,31.55 45.72,29.21 48.26,29.21 48.9,28.57 U$100.JP1.4
CP-(2)  (via drill 0.35)
  Top 0.508: IC7.2 v29.84,13.97 12.06,13.97 9.53,16.51 v9.53,19.68 | IC6.2 v62.23,13.34 | U1.3 41.91,37.47 41.27,38.1 39.37,38.1 38.94,37.67 R65.1 38.1,35.35 38.1,27.94 50.8,15.24 v50.8,14.61
  Bottom 0.508: v29.84,13.97 38.1,13.97 39.37,15.24 48.26,15.24 48.9,14.61 48.9,13.97 49.53,13.34 50.8,13.34 | IC8.2 v9.53,19.68 | IC5.2 90.81,17.78 82.55,17.78 80.64,15.88 72.39,15.88 71.12,14.61 71.12,13.97 70.48,13.34 v62.23,13.34 50.8,13.34 | v50.8,14.61 50.8,13.34
DS-(14)  (via drill 0.35)
  Top 0.508: U6.3 58.59,42.24 59.1,42.75 R76.1 v60.96,45.72 | IC1.14 v89.53,45.72
  Bottom 0.508: v89.53,45.72 v60.96,45.72
GND  (via drill 0.35)
  Top 0.508: 37.47,13.54 37.47,12.27 R52.2 R51.2 R50.2 R49.2 R48.2 R47.2 R46.2 R45.2 | 37.47,13.54 IC7.8 | v36.2,12.06 36.2,12.27 37.47,13.54 | v62.23,12.06 61.59,12.06 61.39,12.27 R45.2 | 69.85,12.27 68.78,12.27 v68.58,12.06 | IC6.8 69.85,12.27 | v82.55,64.14 82.55,56.52 83.19,55.88 IC1.8 v83.19,52.07 87,52.07 88.27,50.8 IC1.13 88.27,45.72 87.42,44.88 R33.2 R34.2 R35.2 R36.2 87.63,26.46 87.63,24.77 88.27,24.13 v90.81,24.13 93.34,24.13 93.89,23.59 93.89,13 R37.2 R38.2 R39.2 R40.2 83.19,12.27 | IC2.8 70.48,46.99 71.75,48.26 71.75,52.07 | 71.75,52.07 IC2.13 v77.47,52.07 | 71.75,52.07 v71.75,54.61 v71.75,57.78 | IC4.13 8.89,49.53 8.26,50.16 3.81,50.16 IC4.8 2.54,53.24 2.54,55.78 4.45,57.68 v4.45,68.58 | IC3.8 25.4,55.88 24.77,55.24 | IC3.13 24.13,50.8 24.77,51.44 24.77,55.24 | 24.77,55.24 v24.77,56.52 | U$100.JP2.7 56.52,52.7 54.61,54.61 52.07,54.61 v50.8,55.88 | R60.2 R59.2 R58.2 | R58.2 R57.2 R56.2 R55.2 R54.2 R53.2 v29.21,10.79 | v15.88,26.67 R61.2 R62.2 R63.2 R64.2 | R58.2 9.53,12.9 v9.53,14.61 | 83.19,12.27 R41.2 R42.2 R43.2 R44.2 69.85,12.27 | R45.2 59.69,12.9 59.69,17.78 60.33,18.41 61.59,18.41 62.23,19.05 IC6.15 | 83.19,12.27 v83.19,13.97 | IC7.15 29.84,19.68 29.21,19.05 v27.3,19.05
  Bottom 0.508: v36.2,12.06 34.92,10.79 v29.21,10.79 29.21,12.7 27.3,14.61 v27.3,19.05 | v62.23,12.06 v68.58,12.06 | OK8.8 1.91,68.58 v4.45,68.58 | OK1.2 97.16,67.94 96.52,68.58 94.61,68.58 | 94.61,68.58 92.08,68.58 | 92.08,68.58 89.53,68.58 | 89.53,68.58 85.09,68.58 | 85.09,68.58 82.55,68.58 | 82.55,68.58 80.01,68.58 | 80.01,68.58 77.47,68.58 | 77.47,68.58 72.39,68.58 | 72.39,68.58 69.85,68.58 | 69.85,68.58 67.31,68.58 | 67.31,68.58 64.77,68.58 | 64.77,68.58 60.33,68.58 | 60.33,68.58 57.78,68.58 | 57.78,68.58 55.24,68.58 | 55.24,68.58 52.7,68.58 | 52.7,68.58 46.99,68.58 | 46.99,68.58 44.45,68.58 | 44.45,68.58 41.91,68.58 | 41.91,68.58 39.37,68.58 | 39.37,68.58 34.92,68.58 | 34.92,68.58 32.38,68.58 | 32.38,68.58 29.84,68.58 | 29.84,68.58 27.3,68.58 | 27.3,68.58 21.59,68.58 | 21.59,68.58 19.05,68.58 | 19.05,68.58 16.51,68.58 | 16.51,68.58 13.97,68.58 | 13.97,68.58 9.53,68.58 | 9.53,68.58 6.99,68.58 | 6.99,68.58 v4.45,68.58 | 94.61,68.58 OK1.4 | 92.08,68.58 OK1.6 | 89.53,68.58 OK1.8 | 85.09,68.58 OK2.2 | 82.55,68.58 OK2.4 v82.55,64.14 | 80.01,68.58 OK2.6 | 77.47,68.58 OK2.8 77.47,65.41 71.75,59.69 v71.75,57.78 | 72.39,68.58 OK3.2 | 69.85,68.58 OK3.4 | 67.31,68.58 OK3.6 | 64.77,68.58 OK3.8 | 60.33,68.58 OK4.2 | 57.78,68.58 OK4.4 | 55.24,68.58 OK4.6 | 52.7,68.58 OK4.8 52.7,65.41 50.8,63.5 v50.8,55.88 52.07,54.61 v71.75,54.61 | 46.99,68.58 OK5.2 | 44.45,68.58 OK5.4 | 41.91,68.58 OK5.6 | 39.37,68.58 OK5.8 | 34.92,68.58 OK6.2 | 32.38,68.58 OK6.4 | 29.84,68.58 OK6.6 | 27.3,68.58 OK6.8 27.3,65.41 24.77,62.87 v24.77,56.52 | 21.59,68.58 OK7.2 | 19.05,68.58 OK7.4 | 16.51,68.58 OK7.6 | 13.97,68.58 OK7.8 | 9.53,68.58 OK8.2 | 6.99,68.58 OK8.4 | v4.45,68.58 OK8.6 | v77.47,52.07 v83.19,52.07 | v90.81,24.13 IC5.15
  Bottom 0.508: v15.88,26.67 16.51,26.67 17.14,26.04 IC8.8 17.14,20.95 15.24,19.05 10.79,19.05 9.53,17.78 IC8.15 v9.53,14.61 | IC5.8 v83.19,13.97
N$1
  Top 0.508: R26.1 19.58,59.48 12.7,52.6 IC4.1
N$2
  Top 0.508: IC1.9 83.19,48.26 78.11,53.34 IC2.14
N$3  (via drill 0.35)
  Top 0.508: IC3.14 v23.5,49.53 | IC2.9 v77.47,46.99
  Bottom 0.508: v23.5,49.53 38.1,49.53 39.37,48.26 72.39,48.26 73.66,46.99 v77.47,46.99
N$4  (via drill 0.35)
  Top 0.508: IC4.14 v10.16,50.16 | v19.68,55.88 IC3.9
  Bottom 0.508: v10.16,50.16 10.16,53.98 12.06,55.88 v19.68,55.88
N$5  (via drill 0.35)
  Top 0.508: R25.2 v22.86,64.14
  Bottom 0.508: OK7.1 v22.86,64.14
N$6  (via drill 0.35)
  Top 0.508: IC1.6 v85.72,55.88
  Bottom 0.508: v85.72,55.88 85.72,56.52 85.09,57.15 82.98,57.15 81.28,58.85 R7.1
N$7  (via drill 0.35)
  Top 0.508: IC1.5 v87,55.88
  Bottom 0.508: R6.1 84.66,59.48 87,57.15 v87,55.88
N$8  (via drill 0.35)
  Top 0.508: IC1.4 v88.27,55.88
  Bottom 0.508: v88.27,55.88 88.27,57.78 87.63,58.42 R5.1
N$9
  Top 0.508: IC1.3 89.53,57.15 88.27,58.42 R4.1
N$10
  Top 0.508: IC1.2 90.81,57.15 91.44,57.78 R3.1
N$11
  Top 0.508: IC1.1 92.08,56.52 94.61,59.05 R2.1
N$12
  Top 0.508: IC1.15 90.81,49.53 93.34,52.07 93.34,55.88 95.25,57.78 96.52,57.78 97.79,59.05 R1.1
N$13  (via drill 0.35)
  Top 0.508: IC1.7 v84.45,55.88
  Bottom 0.508: v84.45,55.88 80.64,55.88 78.11,58.42 R8.1
N$14  (via drill 0.35)
  Top 0.508: R1.2 97.79,63.5 v98.42,64.14
  Bottom 0.508: OK1.1 v98.42,64.14
N$15  (via drill 0.35)
  Top 0.508: R2.2 v94.61,64.14
  Bottom 0.508: OK1.3 95.89,64.77 95.25,64.14 v94.61,64.14
N$16  (via drill 0.35)
  Top 0.508: R3.2 91.44,63.5 v92.08,64.14
  Bottom 0.508: OK1.5 93.34,64.77 92.71,64.14 v92.08,64.14
N$17  (via drill 0.35)
  Top 0.508: R4.2 88.27,63.5 88.9,64.14 v89.53,64.14
  Bottom 0.508: OK1.7 90.81,64.77 90.17,64.14 v89.53,64.14
N$18
  Bottom 0.508: OK2.1 86.36,64.77 87.63,63.5 R5.2
N$19
  Bottom 0.508: OK2.3 83.82,64.14 84.45,63.5 R6.2
N$20
  Bottom 0.508: OK1.15 97.16,74.93 97.79,75.56 U$1.1
N$21
  Bottom 0.508: OK1.13 94.61,74.93 95.25,75.56 U$1.2
N$22
  Bottom 0.508: OK1.11 92.08,74.93 92.71,75.56 U$1.3
N$23
  Bottom 0.508: OK1.9 89.53,74.93 90.17,75.56 U$1.4
N$24
  Bottom 0.508: U$2.1 85.72,75.56 85.09,74.93 OK2.15
N$25
  Bottom 0.508: U$2.2 83.19,75.56 82.55,74.93 OK2.13
N$26
  Bottom 0.508: U$2.3 80.64,75.56 80.01,74.93 OK2.11
N$27
  Bottom 0.508: OK2.9 77.47,74.93 78.11,75.56 U$2.4
N$28
  Bottom 0.508: OK2.5 R7.2
N$29
  Bottom 0.508: OK2.7 78.74,64.14 78.11,63.5 R8.2
N$30
  Top 0.508: IC2.1 68.83,55.88 68.83,58.22 R10.1
N$31
  Top 0.508: 66.88,59.48 R11.1 66.67,59.36 66.67,55.88 67.94,54.61 IC2.2
N$32
  Top 0.508: R12.1 63.7,59.48 63.5,59.28 63.5,57.15 67.31,53.34 IC2.3
N$33  (via drill 0.35)
  Top 0.508: IC2.4 66.67,52.07 v62.87,55.88
  Bottom 0.508: v62.87,55.88 R13.1
N$34  (via drill 0.35)
  Top 0.508: IC2.5 66.04,50.8 59.69,57.15 v59.69,57.78
  Bottom 0.508: v59.69,57.78 R14.1
N$35  (via drill 0.35)
  Top 0.508: IC2.6 65.41,49.53 v57.15,57.78
  Bottom 0.508: v57.15,57.78 56.52,58.42 R15.1
N$36  (via drill 0.35)
  Top 0.508: IC2.7 64.77,48.26 55.24,57.78 v53.34,57.78
  Bottom 0.508: v53.34,57.78 R16.1
N$37
  Top 0.508: R9.1 73.41,55.5 74.3,54.61 IC2.15
N$38  (via drill 0.35)
  Top 0.508: v73.66,64.14 73.66,62.69 R9.2
  Bottom 0.508: OK3.1 v73.66,64.14
N$39  (via drill 0.35)
  Top 0.508: v70.48,64.14 69.85,63.5 69.85,62.69 R10.2
  Bottom 0.508: OK3.3 71.12,64.77 v70.48,64.14
N$40  (via drill 0.35)
  Top 0.508: v67.31,64.14 66.67,63.5 66.67,62.56 R11.2
  Bottom 0.508: OK3.5 68.58,64.77 67.94,64.14 v67.31,64.14
N$41  (via drill 0.35)
  Top 0.508: v64.77,64.14 64.14,64.14 63.5,63.5 R12.2
  Bottom 0.508: OK3.7 66.04,64.77 65.41,64.14 v64.77,64.14
N$42
  Bottom 0.508: OK4.1 61.59,64.77 62.87,63.5 R13.2
N$43
  Bottom 0.508: OK4.3 59.05,62.87 59.48,62.44 R14.2
N$44
  Bottom 0.508: OK4.5 R15.2
N$45
  Bottom 0.508: OK4.7 53.98,64.14 53.34,63.5 R16.2
N$46  (via drill 0.35)
  Top 0.508: v31.11,57.78 31.11,55.35 29.11,53.34 IC3.6
  Bottom 0.508: v31.11,57.78 R23.1
N$47  (via drill 0.35)
  Top 0.508: v34.29,57.78 34.29,56.62 29.74,52.07 IC3.5
  Bottom 0.508: v34.29,57.78 R22.1
N$48  (via drill 0.35)
  Top 0.508: v37.47,57.78 30.48,50.8 IC3.4
  Bottom 0.508: v37.47,57.78 R21.1
N$49
  Top 0.508: IC3.3 31.11,49.53 38.73,57.15 R20.1
N$50
  Top 0.508: R19.1 41.91,58.22 31.95,48.26 IC3.2
N$51
  Top 0.508: R18.1 45.09,58.85 33.23,46.99 IC3.1
N$52  (via drill 0.35)
  Top 0.508: IC3.7 v26.04,54.61
  Bottom 0.508: v26.04,54.61 26.04,56.52 27.94,58.42 R24.1
N$53
  Top 0.508: R17.1 48.05,59.48 34.29,45.72 26.04,45.72 25.65,46.1 25.65,47.49 24.88,48.26 IC3.15
N$54  (via drill 0.35)
  Top 0.508: R17.2 v48.26,64.14
  Bottom 0.508: OK5.1 v48.26,64.14
N$55  (via drill 0.35)
  Top 0.508: R18.2 v45.09,64.14
  Bottom 0.508: OK5.3 45.72,64.77 v45.09,64.14
N$56  (via drill 0.35)
  Top 0.508: R19.2 v41.91,64.14
  Bottom 0.508: OK5.5 43.18,64.77 42.55,64.14 v41.91,64.14
N$57  (via drill 0.35)
  Top 0.508: R20.2 38.73,63.5 v39.37,64.14
  Bottom 0.508: OK5.7 40.64,64.77 40.01,64.14 v39.37,64.14
N$58
  Bottom 0.508: OK6.1 36.2,64.77 37.47,63.5 R21.2
N$59
  Bottom 0.508: OK6.3 33.66,64.14 34.29,63.5 R22.2
N$60
  Bottom 0.508: OK6.5 R23.2
N$61
  Bottom 0.508: OK6.7 28.57,64.14 27.94,63.5 R24.2
N$62  (via drill 0.35)
  Top 0.508: R26.2 v19.68,64.14
  Bottom 0.508: OK7.3 20.32,64.77 v19.68,64.14
N$63  (via drill 0.35)
  Top 0.508: R27.2 v16.51,64.14
  Bottom 0.508: OK7.5 17.78,64.77 17.14,64.14 v16.51,64.14
N$64  (via drill 0.35)
  Top 0.508: R28.2 13.34,63.5 v13.97,64.14
  Bottom 0.508: OK7.7 15.24,64.77 14.61,64.14 v13.97,64.14
N$65
  Bottom 0.508: OK8.1 10.79,64.77 12.06,63.5 R29.2
N$66
  Bottom 0.508: OK3.15 72.39,73.56 73.66,74.83 U$3.1
N$67
  Bottom 0.508: U$3.2 71.12,74.83 69.85,73.56 OK3.13
N$68
  Bottom 0.508: U$3.3 68.58,74.83 67.31,73.56 OK3.11
N$69
  Bottom 0.508: U$3.4 66.04,74.83 64.77,73.56 OK3.9
N$70
  Bottom 0.508: U$4.1 61.59,74.83 60.33,73.56 OK4.15
N$71
  Bottom 0.508: U$4.2 59.05,74.83 57.78,73.56 OK4.13
N$72
  Bottom 0.508: U$4.3 56.52,74.83 55.24,73.56 OK4.11
N$73
  Bottom 0.508: U$4.4 53.98,74.83 52.7,73.56 OK4.9
N$74
  Bottom 0.508: U$5.1 46.99,74.93 OK5.15
N$75
  Bottom 0.508: U$5.2 43.18,75.46 44.45,74.19 OK5.13
N$76
  Bottom 0.508: U$5.3 40.64,75.46 41.91,74.19 OK5.11
N$77
  Bottom 0.508: U$5.4 38.1,74.83 39.37,73.56 OK5.9
N$78
  Bottom 0.508: U$6.1 33.66,74.93 34.92,73.66 OK6.15
N$79
  Bottom 0.508: U$6.2 31.11,74.93 32.38,73.66 OK6.13
N$80
  Bottom 0.508: U$6.3 28.57,74.83 29.84,73.56 OK6.11
N$81
  Bottom 0.508: U$6.4 26.04,74.19 27.3,72.92 OK6.9
N$82
  Top 0.508: U$9.1 94.61,36.2 R33.1
  Bottom 0.508: IC5.11 85.72,33.66 89.53,37.47 93.34,37.47 U$9.1
N$83  (via drill 0.35)
  Top 0.508: U$11.1 78.74,5.71 v80.01,6.99 80.64,7.62 R41.1 | v80.01,13.97 80.01,16.51 74.93,21.59 73.03,21.59 69.85,24.77 68.58,24.77 67.31,23.5 IC6.11
  Bottom 0.508: v80.01,6.99 v80.01,13.97
N$84
  Top 0.508: U$9.3 94.61,29.84 R35.1
  Bottom 0.508: IC5.13 88.27,29.84 89.53,31.11 94.61,31.11 U$9.3
N$85
  Top 0.508: U$9.4 93.98,26.67 R36.1
  Bottom 0.508: IC5.14 89.53,26.04 91.44,27.94 U$9.4
N$86
  Top 0.508: U$9.2 R34.1
  Bottom 0.508: IC5.12 87,31.75 89.53,34.29 93.98,34.29 U$9.2
N$87  (via drill 0.35)
  Top 0.508: R42.1 v77.47,6.99 76.2,5.71 U$11.2 | IC6.12 66.04,20.32 66.67,19.68 74.3,19.68 77.47,16.51 v77.47,13.97
  Bottom 0.508: v77.47,6.99 v77.47,13.97
N$88
  Top 0.508: U$10.1 93.98,5.71 94.61,6.35 R37.1
  Bottom 0.508: IC5.3 89.53,13.97 90.81,12.7 93.34,12.7 93.98,12.06 U$10.1
N$89
  Top 0.508: U$10.2 R38.1
  Bottom 0.508: IC5.4 88.27,13.34 90.17,11.43 90.17,5.71 U$10.2
N$90
  Top 0.508: U$10.3 88.9,5.71 88.27,6.35 R39.1
  Bottom 0.508: IC5.5 87,10.79 87.63,10.16 87.63,5.71 U$10.3
N$91
  Top 0.508: U$10.4 85.09,5.71 R40.1
  Bottom 0.508: IC5.6 85.72,14.61 85.09,13.97 85.09,9.53 85.72,8.89 85.72,5.08 U$10.4
N$92  (via drill 0.35)
  Top 0.508: U$11.3 74.3,5.08 74.3,6.99 | 74.3,6.99 R43.1 | 74.3,6.99 v74.93,6.99 | IC6.13 64.77,19.05 65.41,18.41 73.03,18.41 74.93,16.51 v74.93,13.97
  Bottom 0.508: v74.93,6.99 v74.93,13.97
N$93  (via drill 0.35)
  Top 0.508: U$11.4 71.12,6.99 | 71.12,6.99 R44.1 | 71.12,6.99 v72.39,6.99 | v72.39,13.97 72.39,16.51 71.75,17.14 64.14,17.14 63.5,17.78 IC6.14
  Bottom 0.508: v72.39,6.99 v72.39,13.97
N$94
  Top 0.508: U$12.1 R45.1 62.02,9.32 63.5,10.79 IC6.3
N$95  (via drill 0.35)
  Top 0.508: U$12.2 57.58,4.45 57.15,4.88 57.15,6.99 | R46.1 57.15,6.99 | IC6.4 64.77,8.89 v62.87,6.99 | v58.42,6.99 57.15,6.99
  Bottom 0.508: v58.42,6.99 v62.87,6.99
N$96
  Top 0.508: R47.1 53.98,6.99 55.24,5.71 U$12.3 55.24,3.17 55.88,2.54 65.41,2.54 66.04,3.17 IC6.5
N$97
  Top 0.508: R48.1 50.8,6.35 U$12.4 52.7,2.54 53.98,1.27 66.04,1.27 67.31,2.54 IC6.6
N$98  (via drill 0.35)
  Top 0.508: R49.1 v47.62,6.99 46.35,5.71 U$13.1 | v47.62,13.97 47.62,15.88 38.1,25.4 34.92,25.4 IC7.11
  Bottom 0.508: v47.62,6.99 v47.62,13.97
N$99  (via drill 0.35)
  Top 0.508: IC7.12 33.66,20.85 34.19,20.32 40.64,20.32 45.09,15.88 v45.09,13.97 | R50.1 44.45,6.99 | v45.09,6.99 44.45,6.99 | U$13.2 43.81,6.35 44.45,6.99
  Bottom 0.508: v45.09,13.97 v45.09,6.99
N$100  (via drill 0.35)
  Top 0.508: R51.1 U$13.3 41.27,6.99 v42.55,6.99 | IC7.13 32.38,19.68 33.02,19.05 39.37,19.05 42.55,15.88 v42.55,13.97
  Bottom 0.508: v42.55,13.97 v42.55,6.99
N$101  (via drill 0.35)
  Top 0.508: R52.1 38.1,6.99 | v39.37,6.99 38.1,6.99 | 38.1,6.99 38.1,5.08 U$13.4 | v40.01,13.97 40.01,16.51 38.73,17.78 31.75,17.78 31.11,18.41 IC7.14
  Bottom 0.508: v40.01,13.97 40.01,7.62 v39.37,6.99
N$102
  Top 0.508: U$127.1 29.21,5.71 R53.1 29.64,9.32 31.11,10.79 IC7.3
N$103  (via drill 0.35)
  Top 0.508: 26.04,6.99 26.04,5.08 U$127.2 | 26.04,6.99 R54.1 | v30.48,6.99 32.38,8.89 IC7.4 | 26.04,6.99 v26.67,6.99
  Bottom 0.508: v26.67,6.99 v30.48,6.99
N$104
  Top 0.508: R55.1 U$127.3 22.86,3.17 23.5,2.54 33.02,2.54 33.66,3.17 IC7.5
N$105
  Top 0.508: R56.1 19.68,5.08 U$127.4 20.32,2.54 21.59,1.27 33.66,1.27 34.92,2.54 IC7.6
N$106
  Bottom 0.508: R30.2 8.89,63.5 8.26,64.14 OK8.3
N$107
  Bottom 0.508: R31.2 OK8.5
N$108
  Bottom 0.508: R32.2 2.54,63.5 3.17,64.14 OK8.7
N$109
  Top 0.508: IC4.2 11.43,53.34 16.51,58.42 R27.1
N$110
  Top 0.508: IC4.3 10.16,53.98 13.34,57.15 R28.1
N$111  (via drill 0.35)
  Top 0.508: IC4.4 v8.89,54.61
  Bottom 0.508: R29.1 12.06,57.78 v8.89,54.61
N$112  (via drill 0.35)
  Top 0.508: v7.62,55.24 IC4.5
  Bottom 0.508: R30.1 8.89,56.52 v7.62,55.24
N$113  (via drill 0.35)
  Top 0.508: v6.35,55.24 IC4.6
  Bottom 0.508: R31.1 6.35,58.85 v6.35,55.24
N$114  (via drill 0.35)
  Top 0.508: IC4.7 5.08,54.61 v4.45,55.24
  Bottom 0.508: R32.1 2.54,57.15 v4.45,55.24
N$116
  Top 0.508: R25.1 22.86,59.05 21.59,57.78 19.68,57.78 13.97,52.07 13.97,50.16 11.43,47.62 IC4.15
N$117
  Bottom 0.508: U$7.1 OK7.15
N$118
  Bottom 0.508: U$7.2 OK7.13
N$119
  Bottom 0.508: U$7.3 OK7.11
N$120
  Bottom 0.508: OK7.9 U$7.4
N$121
  Bottom 0.508: U$8.1 9.65,72.42 OK8.15
N$122
  Bottom 0.508: U$8.2 7.11,72.42 OK8.13
N$123
  Bottom 0.508: U$8.3 4.57,72.42 OK8.11
N$124
  Bottom 0.508: U$8.4 2.03,72.42 OK8.9
N$125
  Top 0.508: R57.1 13.34,6.35 12.7,5.71 U$15.1
  Bottom 0.508: U$15.1 14.61,6.35 IC8.11
N$126
  Top 0.508: R58.1 U$15.2
  Bottom 0.508: U$15.2 10.16,6.35 13.34,9.53 IC8.12
N$127
  Top 0.508: R59.1 6.99,6.35 7.62,5.71 U$15.3
  Bottom 0.508: U$15.3 7.62,6.99 12.06,11.43 IC8.13
N$128
  Top 0.508: R60.1 3.81,5.71 U$15.4
  Bottom 0.508: U$15.4 5.08,7.62 10.79,13.34 IC8.14
N$129
  Top 0.508: U$16.1 6.35,26.67 R61.1
  Bottom 0.508: U$16.1 9.53,27.94 10.79,26.67 IC8.3
N$130
  Top 0.508: U$16.2 5.71,29.84 R62.1
  Bottom 0.508: U$16.2 10.79,30.48 12.06,29.21 IC8.4
N$131
  Top 0.508: U$16.3 R63.1
  Bottom 0.508: U$16.3 11.43,33.02 13.34,31.11 13.34,26.67 IC8.5
N$132
  Top 0.508: U$16.4 5.71,36.2 R64.1
  Bottom 0.508: U$16.4 5.71,34.92 12.06,34.92 14.61,32.38 IC8.6
PL
  Top 0.508: U2.2 50.37,32.53 R68.1 50.37,29.64 51.44,28.57 U$100.JP1.5
PL-(1)  (via drill 0.35)
  Top 0.305: 52.7,24.77 52.7,29.84
  Top 0.508: IC7.1 v28.57,17.78 13.34,17.78 10.16,20.95 v8.26,20.95 | IC6.1 v60.96,17.14 | U2.3 47.95,38.1 48.9,38.1 50.59,36.4 R67.1 52.7,34.09 52.7,29.84 | v52.7,18.41 52.7,24.77
  Bottom 0.508: v28.57,17.78 38.73,17.78 39.37,17.14 52.7,17.14 | 52.7,17.14 v60.96,17.14 80.01,17.14 81.92,19.05 91.44,19.05 92.08,18.41 IC5.1 | IC8.1 v8.26,20.95 | 52.7,17.14 v52.7,18.41
Q7
  Top 0.508: U3.2 57.99,34.44 R70.2 57.99,31.32 U$100.JP1.6
Q7-(9)  (via drill 0.35)
  Top 0.508: U3.3 57.48,38.1 59.05,38.1 60.12,37.03 R69.1 v61.59,36.2
  Bottom 0.508: IC8.9 19.79,16.61 34.92,31.75 34.92,34.29 38.73,38.1 55.88,38.1 57.78,36.2 v61.59,36.2
Q7-DS-1  (via drill 0.35)
  Top 0.508: v69.22,23.5 68.58,22.86 IC6.10
  Bottom 0.508: v69.22,23.5 71.12,23.5 74.3,20.32 82.55,20.32 83.19,20.95 IC5.9
Q7-DS-2  (via drill 0.35)
  Top 0.508: IC6.9 69.95,21.59 v71.12,21.59 | IC7.10 v36.2,24.13
  Bottom 0.508: v71.12,21.59 41.91,21.59 39.37,24.13 v36.2,24.13
Q7-DS-3  (via drill 0.35)
  Top 0.508: v38.73,22.23 38.2,22.76 37.47,22.76 IC7.9
  Bottom 0.508: IC8.10 15.88,14.61 16.51,13.97 24.13,13.97 26.04,15.88 26.04,20.95 27.3,22.23 v38.73,22.23
SHCP-(11)  (via drill 0.35)
  Top 0.508: IC1.11 v85.72,49.53 | IC2.11 v77.47,49.53 | v7.62,48.9 6.99,48.9 6.35,48.26 IC4.11 v6.35,43.81 | v19.68,53.34 IC3.11 | R72.1 34.29,43.18 | 34.29,43.18 35.26,43.18 U4.3 | 34.29,43.18 v34.29,44.45
  Bottom 0.508: v77.47,49.53 v85.72,49.53 85.72,52.07 84.45,53.34 v19.68,53.34 15.24,53.34 10.79,48.9 v7.62,48.9 | v34.29,44.45 6.99,44.45 v6.35,43.81
STCP-(12)  (via drill 0.35)
  Top 0.508: IC2.12 v77.47,50.8 | v7.62,47.62 IC4.12 v7.62,42.55 | v19.68,52.07 IC3.12 | v83.82,50.8 86.36,50.8 87,50.16 IC1.12 | R74.1 34.29,38.73 | 34.29,38.73 34.92,38.73 37.47,41.27 U5.3 | v34.29,40.01 34.29,38.73
  Bottom 0.508: v83.82,50.8 v77.47,50.8 76.2,50.8 74.93,52.07 v19.68,52.07 17.14,52.07 12.7,47.62 v7.62,47.62 | v34.29,40.01 33.02,41.27 8.89,41.27 v7.62,42.55
VCC  (via drill 0.35)
  Top 0.508: v60.96,19.68 IC6.16 60.96,23.5 63.07,25.61 R69.2 62.87,36.2 60.96,38.1 60.96,39.37 | IC7.16 v28.57,20.32 | IC2.16 75.56,55.98 | 75.56,55.98 75.56,55.88 77.47,55.88 84.45,48.9 IC1.10 v84.45,44.45 83.19,44.45 81.92,45.72 81.92,46.99 80.64,48.26 IC2.10 73.66,48.26 71.12,45.72 67.31,45.72 66.04,46.99 64.14,46.99 60.96,50.16 U$100.JP2.8 59.05,52.07 55.24,55.88 52.7,55.88 50.8,57.78 v50.8,72.39 | 75.56,55.98 v75.56,72.39 | v24.77,72.39 24.77,58.42 23.5,57.15 23.5,55.24 22.86,54.61 IC3.10 19.05,54.61 18.41,53.98 18.41,46.99 | v1.91,69.85 1.27,69.22 1.27,49.53 1.91,48.9 | 1.91,48.9 2.54,48.26 4.45,48.26 5.08,47.62 IC4.10 5.08,42.55 6.35,41.27 11.43,41.27 12.7,42.55 12.7,44.45 | 12.7,44.45 IC4.16 | 12.7,44.45 15.24,46.99 18.41,46.99 | IC1.16 v92.08,44.45 96.52,44.45 97.79,43.18 97.79,24.13 96.52,22.86 v95.25,22.86 | 1.91,48.9 1.91,24.77 v8.26,18.41 | R67.2 53.55,39.37 | 60.96,39.37 53.55,39.37 | 53.55,39.37 37.9,39.37 35.99,37.47 R65.2 32.18,36.2 R74.2 | R76.2 60.96,39.37 | R74.2 R72.2 | R74.2 21.69,46.68 IC3.16 18.41,46.99
  Bottom 0.508: v28.57,20.32 59.05,20.32 59.69,19.68 v60.96,19.68 | OK1.16 98.42,70.48 97.79,69.85 95.89,69.85 | 95.89,69.85 93.34,69.85 | 93.34,69.85 90.81,69.85 | 90.81,69.85 86.36,69.85 | 86.36,69.85 83.82,69.85 | 83.82,69.85 81.28,69.85 | 81.28,69.85 78.74,69.85 | 78.74,69.85 73.66,69.85 | 73.66,69.85 71.12,69.85 | 71.12,69.85 68.58,69.85 | 68.58,69.85 66.04,69.85 | 66.04,69.85 61.59,69.85 | 61.59,69.85 59.05,69.85 | 59.05,69.85 56.52,69.85 | 56.52,69.85 53.98,69.85 | 53.98,69.85 48.26,69.85 | 48.26,69.85 45.72,69.85 | 45.72,69.85 43.18,69.85 | 43.18,69.85 40.64,69.85 | 40.64,69.85 36.2,69.85 | 36.2,69.85 33.66,69.85 | 33.66,69.85 31.11,69.85 | 31.11,69.85 28.57,69.85 | 28.57,69.85 22.86,69.85 | 22.86,69.85 20.32,69.85 | 20.32,69.85 17.78,69.85 | 17.78,69.85 15.24,69.85 | 15.24,69.85 10.79,69.85 | 10.79,69.85 8.26,69.85 | 8.26,69.85 5.71,69.85 | 3.17,69.85 OK8.10 | OK8.12 5.71,69.85 | OK8.14 8.26,69.85 | OK8.16 10.79,69.85 | OK7.10 15.24,69.85 | OK7.12 17.78,69.85 | OK7.14 20.32,69.85 | 22.86,69.85 OK7.16 24.66,72.29 v24.77,72.39 | OK6.10 28.57,69.85 | OK6.12 31.11,69.85 | OK6.14 33.66,69.85 | OK6.16 36.2,69.85 | OK5.10 40.64,69.85 | OK5.12 43.18,69.85 | OK5.14 45.72,69.85 | 48.26,69.85 OK5.16 50.7,72.29 v50.8,72.39 | OK4.10 53.98,69.85 | OK4.12 56.52,69.85 | OK4.14 59.05,69.85 | OK4.16 61.59,69.85 | OK3.10 66.04,69.85 | OK3.12 68.58,69.85 | OK3.14 71.12,69.85 | 73.66,69.85 OK3.16 75.46,72.29 v75.56,72.39 | OK2.10 78.74,69.85 | OK2.12 81.28,69.85 | OK2.14 83.82,69.85 | OK2.16 86.36,69.85 | OK1.10 90.81,69.85 | OK1.12 93.34,69.85 | OK1.14 95.89,69.85 | 3.17,69.85 v1.91,69.85 | 5.71,69.85 3.17,69.85 | v92.08,44.45 v84.45,44.45 | v95.25,22.86 92.08,22.86 IC5.16 | IC8.16 v8.26,18.41

### Text on the board
tNames: [cabletester v2] | TOP | (c) 2022 - birot.
bNames: 32 | 29 | 28 | 25 | 24 | 21 | 20 | 17 | 16 | 13 | 12 | 9 | 8 | 5 | 4 | 1 | 32 | 1 | 29 | 4 | - | 28 | 25 | 24 | 21 | 20 | 17 | 16 | 13 | 12 | 9 | 8 | 5